# EAGLE board zulu_a7 (EAGLE 9.7.0), part 1 of 2
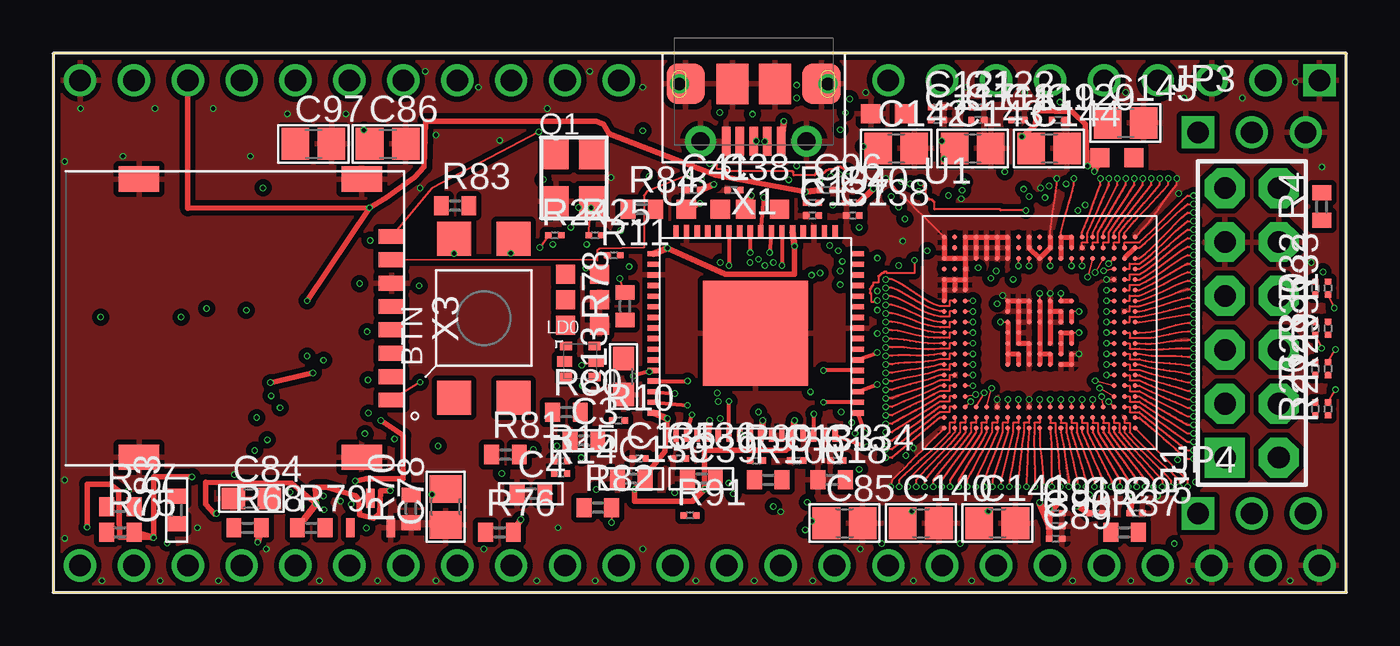
[diagram p7: board, top side]
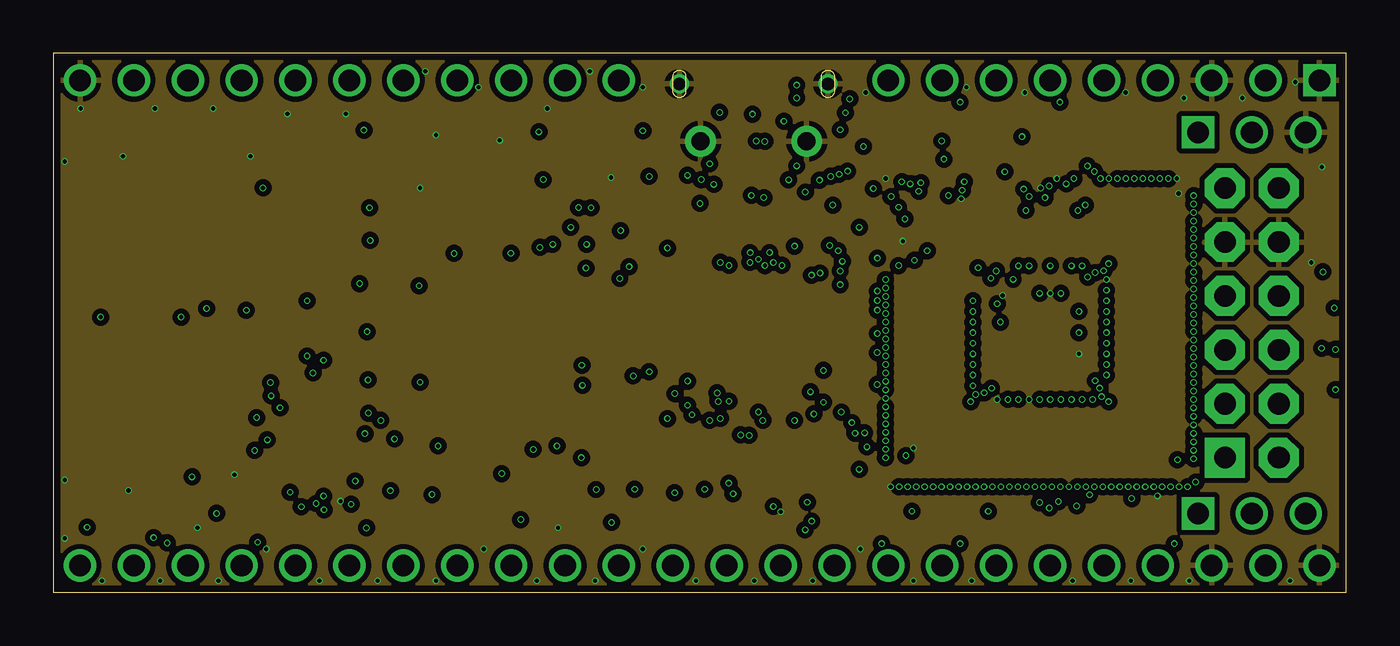
[diagram p8: board, inner layer Route2]
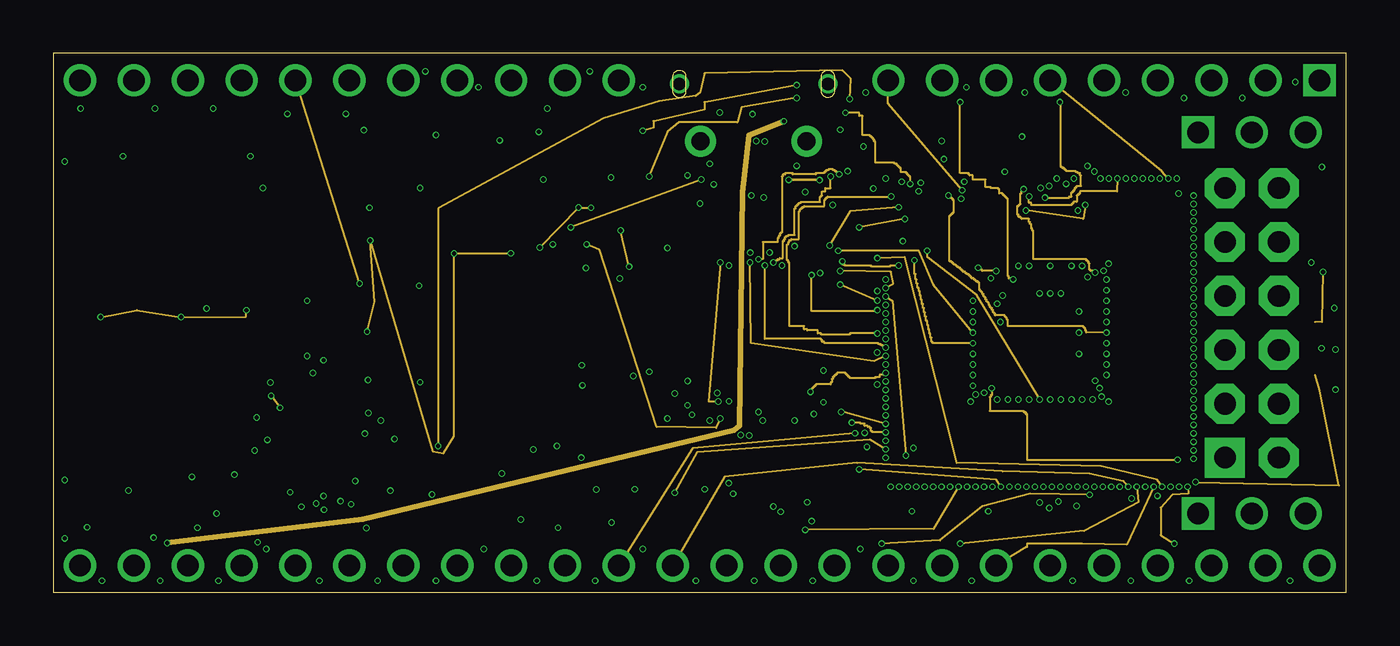
[diagram p9: board, inner layer Route3]
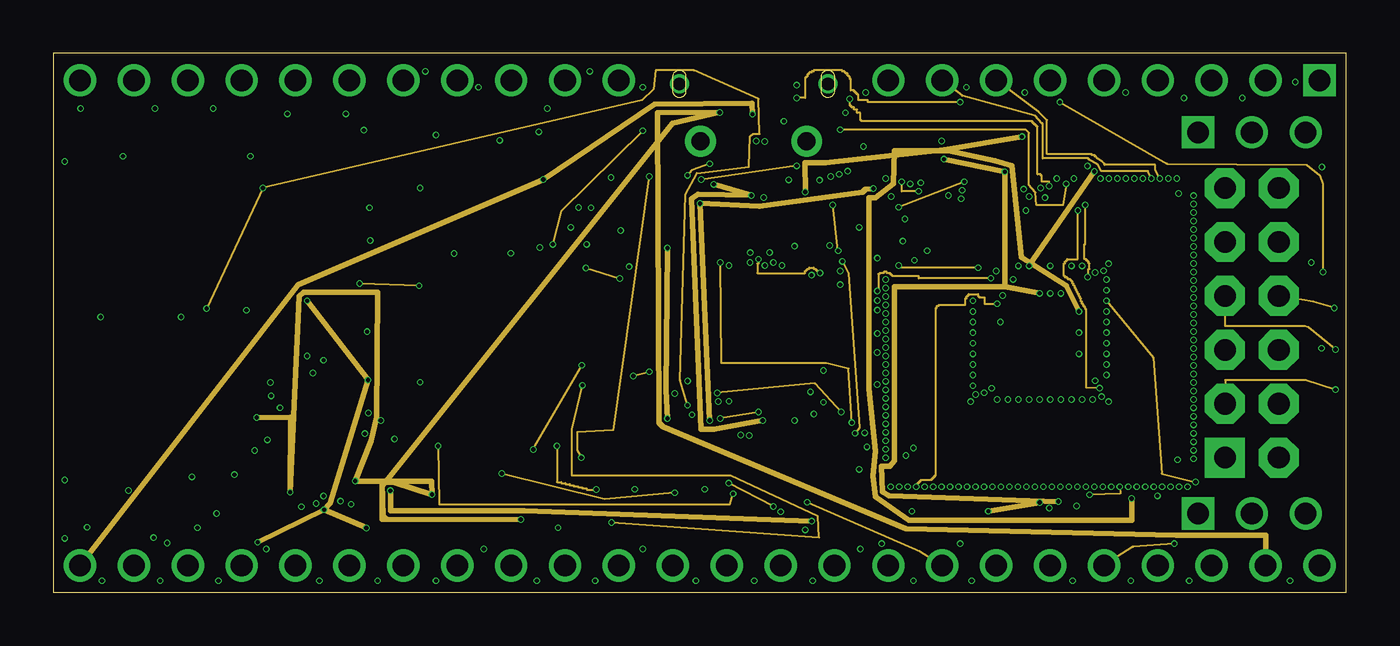
[diagram p10: board, inner layer Route4]
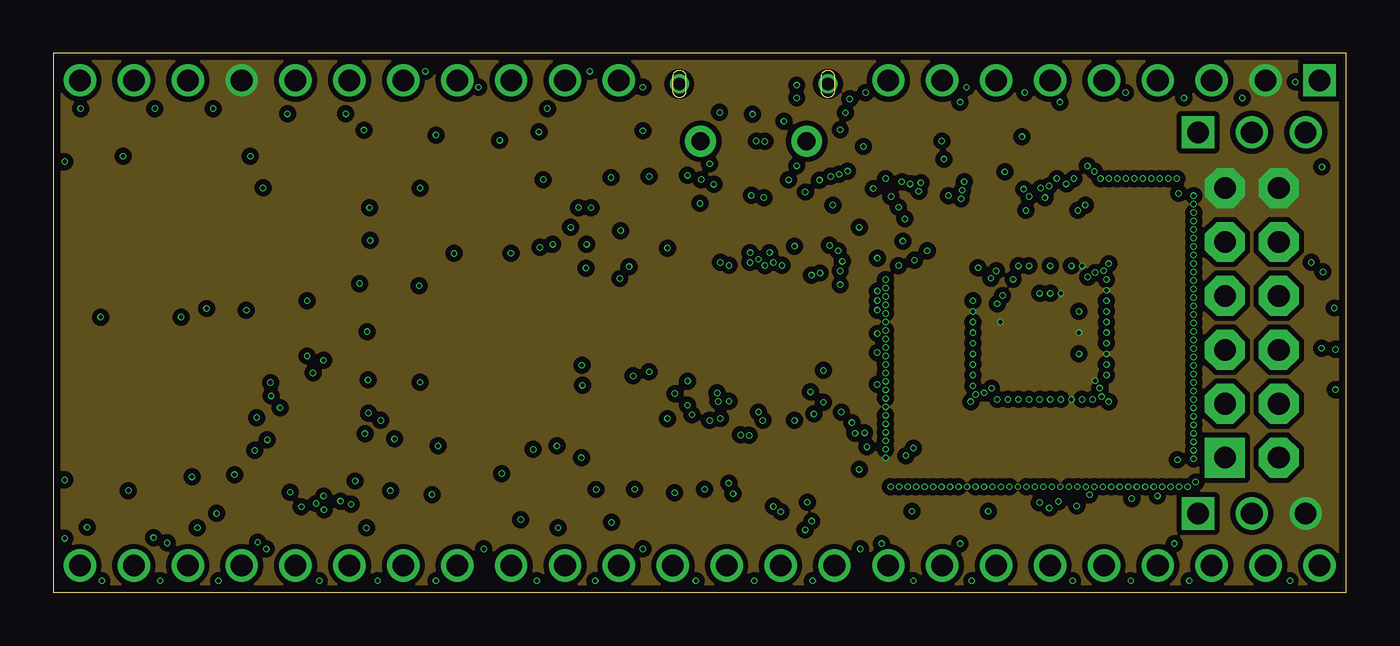
[diagram p11: board, inner layer Route5]
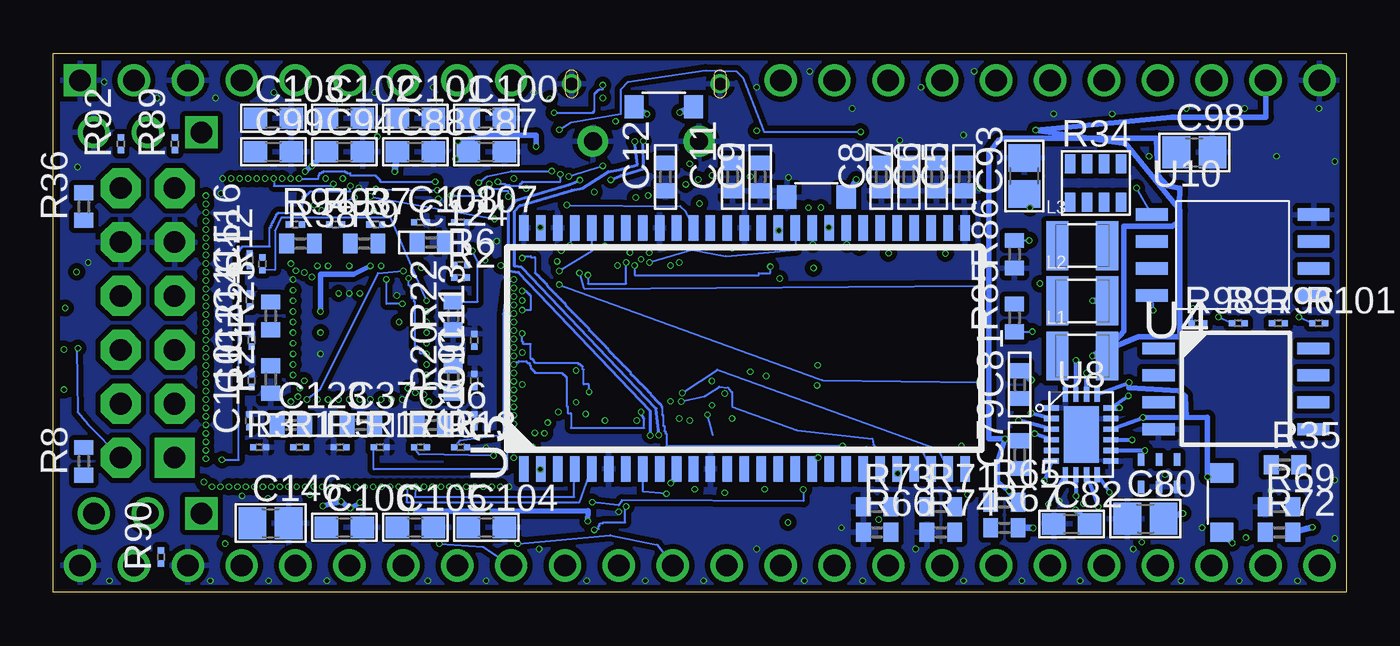
[diagram p12: board, bottom side, seen from below]

Size 60.96 x 25.4 mm. Coordinates in mm from the lower left corner, seen from the top.
Outline: 0,0 60.96,0 60.96,25.4 0,25.4 0,0
Copper layers (1*2*3*4*5*16): Top 0.035mm / dielectric 0.0994mm / Route2 0.0152mm / dielectric 0.55mm / Route3 0.0152mm / dielectric 0.1164mm / Route4 0.0152mm / dielectric 0.55mm / Route5 0.0152mm / dielectric 0.0994mm / Bottom
Design rules "Zulu A7 6 layer JLCPCB": minimum track width 0.0762mm, minimum drill 0.2mm, track to track 0.09mm, track to pad 0.09mm, pad to pad 0.09mm, via to via 0.09mm, smd to smd 0.09mm, copper to edge 0.3mm, drill to drill 0.2mm, minimum pad ring 0.1mm, minimum via ring 0.05mm, stop-mask expansion 0.05mm, vias tented up to drill 0mm, thermal gap 0.25mm
Net classes: 1 power: clearance 0.254 mm; 2 usb-diff: width 0.15 mm, clearance 0.125 mm

## Footprints (pad centres in the part's own frame; a part is rotated, then mirrored left to right if it is on the bottom)
PTA-142 = smd 1.6 x 1.6: 1 -3.75,1.4; 2 -3.75,-1.4; 3 3.75,-1.4; 4 3.75,1.4
C0402 = smd 0.7 x 0.9: 1 -0.65,0; 2 0.65,0
C0603 = smd 1.1 x 1: 1 -0.85,0; 2 0.85,0
C0201 = smd 0.3 x 0.3: 1 -0.3,0; 2 0.3,0
C0805 = smd 1.3 x 1.5: 1 -0.85,0; 2 0.85,0
SOD123 = smd 0.9 x 1.1: A -1.4,0; K 1.4,0
2X06 = drill 1.016 pad 1.88 square: 1 -6.35,1.27 | drill 1.016 pad 1.88 octagon: 2 -3.81,1.27; 3 -1.27,1.27; 4 1.27,1.27; 5 3.81,1.27; 6 6.35,1.27; 7 -6.35,-1.27; 8 -3.81,-1.27; 9 -1.27,-1.27; 10 1.27,-1.27; 11 3.81,-1.27; 12 6.35,-1.27
1X03-NOSILK = drill 1.016 square: 1 -2.54,0 | drill 1.016: 2 0,0; 3 2.54,0
IND2520 = smd 1.05 x 2.3: 1 -1.175,0; 2 1.175,0
IND0603 = smd 0.9 x 0.9: 1 -0.8,0; 2 0.8,0
VS-NRD8 = smd 0.55 x 0.4: 1 -0.675,0.725; 3 -0.675,-0.725; 4 0.675,0.725; 6 0.675,-0.725 | smd 0.7 x 0.5: 2 -0.75,0; 5 0.75,0
LED0603 = smd 0.9 x 0.9: A -0.8,0; K 0.8,0
32X25 = smd 1.2 x 1.4: 1 0,0; 2 0,-2.2; 3 1.7,-2.2; 4 1.7,0
SOT23-3 = smd 0.4 x 0.9: D 0,0.7; G -0.95,-0.7; S 0.95,-0.7
SOT363 = smd 0.3 x 0.6: 1 -0.85,-0.65; 2 0,-0.65; 3 0.85,-0.65; 4 0.85,0.65; 5 0,0.65; 6 -0.85,0.65
R0201 = smd 0.3 x 0.3: 1 -0.3,0; 2 0.3,0
R0402 = smd 0.7 x 0.9: 1 -0.65,0; 2 0.65,0
742C083 = smd 0.5 x 0.9: 1 -0.4,-0.9; 2 0.4,-0.9; 3 1.2,-0.9; 4 2,-0.9; 5 2,0.9; 6 1.2,0.9; 7 0.4,0.9; 8 -0.4,0.9
XC7A35T-CPG236 = smd 0.225 x 0.225: A1 0,0; A2 0.5,0; A3 1,0; A4 1.5,0; A5 2,0; A6 2.5,0; A7 3,0; A8 3.5,0; A9 4,0; A10 4.5,0; A11 5,0; A12 5.5,0; A13 6,0; A14 6.5,0; A15 7,0; A16 7.5,0; A17 8,0; A18 8.5,0; A19 9,0; B1 0,-0.5; B2 0.5,-0.5; B3 1,-0.5; B4 1.5,-0.5; B5 2,-0.5; B6 2.5,-0.5; B7 3,-0.5; B8 3.5,-0.5; B9 4,-0.5; B10 4.5,-0.5; B11 5,-0.5; B12 5.5,-0.5; B13 6,-0.5; B14 6.5,-0.5; B15 7,-0.5; B16 7.5,-0.5; B17 8,-0.5; B18 8.5,-0.5; B19 9,-0.5; C1 0,-1; C2 0.5,-1; C3 1,-1; C4 1.5,-1; C5 2,-1; C6 2.5,-1; C7 3,-1; C8 3.5,-1; C9 4,-1; C10 4.5,-1; C11 5,-1; C12 5.5,-1; C13 6,-1; C14 6.5,-1; C15 7,-1; C16 7.5,-1; C17 8,-1; C18 8.5,-1; C19 9,-1; D1 0,-1.5; D2 0.5,-1.5; D3 1,-1.5; D17 8,-1.5; D18 8.5,-1.5; D19 9,-1.5; E1 0,-2; E2 0.5,-2; E3 1,-2; E17 8,-2; E18 8.5,-2; E19 9,-2; F1 0,-2.5; F2 0.5,-2.5; F3 1,-2.5; F17 8,-2.5; F18 8.5,-2.5; F19 9,-2.5; G1 0,-3; G2 0.5,-3; G3 1,-3; G7 3,-3; G8 3.5,-3; G9 4,-3; G10 4.5,-3; G11 5,-3; G12 5.5,-3; G13 6,-3; G17 8,-3; G18 8.5,-3; G19 9,-3; H1 0,-3.5; H2 0.5,-3.5; H3 1,-3.5; H7 3,-3.5; H8 3.5,-3.5; H9 4,-3.5; H10 4.5,-3.5; H11 5,-3.5; H12 5.5,-3.5; H13 6,-3.5; H17 8,-3.5; H18 8.5,-3.5; H19 9,-3.5; J1 0,-4; J2 0.5,-4; J3 1,-4; J7 3,-4; J8 3.5,-4; J9 4,-4; J10 4.5,-4; J11 5,-4; J12 5.5,-4; J13 6,-4; J17 8,-4; J18 8.5,-4; J19 9,-4; K1 0,-4.5; K2 0.5,-4.5; K3 1,-4.5; K7 3,-4.5; K8 3.5,-4.5; K12 5.5,-4.5; K13 6,-4.5; K17 8,-4.5; K18 8.5,-4.5; K19 9,-4.5; L1 0,-5; L2 0.5,-5; L3 1,-5; L7 3,-5; L8 3.5,-5; L9 4,-5; L10 4.5,-5; L11 5,-5; L12 5.5,-5; L13 6,-5; L17 8,-5; L18 8.5,-5; L19 9,-5; M1 0,-5.5; M2 0.5,-5.5; M3 1,-5.5; M7 3,-5.5; M8 3.5,-5.5; M9 4,-5.5; M10 4.5,-5.5; M11 5,-5.5; M12 5.5,-5.5; M13 6,-5.5; M17 8,-5.5; M18 8.5,-5.5; M19 9,-5.5; N1 0,-6; N2 0.5,-6; N3 1,-6; N7 3,-6; N8 3.5,-6; N9 4,-6; N10 4.5,-6; N11 5,-6; N12 5.5,-6; N13 6,-6; N17 8,-6; N18 8.5,-6; N19 9,-6; P1 0,-6.5; P2 0.5,-6.5; P3 1,-6.5; P17 8,-6.5; P18 8.5,-6.5; P19 9,-6.5; R1 0,-7; R2 0.5,-7; R3 1,-7; R17 8,-7; R18 8.5,-7; R19 9,-7; T1 0,-7.5; T2 0.5,-7.5; T3 1,-7.5; T17 8,-7.5; T18 8.5,-7.5; T19 9,-7.5; U1 0,-8; U2 0.5,-8; U3 1,-8; U4 1.5,-8; U5 2,-8; U6 2.5,-8; U7 3,-8; U8 3.5,-8; U9 4,-8; U10 4.5,-8; U11 5,-8; U12 5.5,-8; U13 6,-8; U14 6.5,-8; U15 7,-8; U16 7.5,-8; U17 8,-8; U18 8.5,-8; U19 9,-8; V1 0,-8.5; V2 0.5,-8.5; V3 1,-8.5; V4 1.5,-8.5; V5 2,-8.5; V6 2.5,-8.5; V7 3,-8.5; V8 3.5,-8.5; V9 4,-8.5; V10 4.5,-8.5; V11 5,-8.5; V12 5.5,-8.5; V13 6,-8.5; V14 6.5,-8.5; V15 7,-8.5; V16 7.5,-8.5; V17 8,-8.5; V18 8.5,-8.5; V19 9,-8.5; W1 0,-9; W2 0.5,-9; W3 1,-9; W4 1.5,-9; W5 2,-9; W6 2.5,-9; W7 3,-9; W8 3.5,-9; W9 4,-9; W10 4.5,-9; W11 5,-9; W12 5.5,-9; W13 6,-9; W14 6.5,-9; W15 7,-9; W16 7.5,-9; W17 8,-9; W18 8.5,-9; W19 9,-9
FT2232HQ-QFN64 = smd 0.25 x 0.6: 1 -3.75,-4.8; 2 -3.25,-4.8; 3 -2.75,-4.8; 4 -2.25,-4.8; 5 -1.75,-4.8; 6 -1.25,-4.8; 7 -0.75,-4.8; 8 -0.25,-4.8; 9 0.25,-4.8; 10 0.75,-4.8; 11 1.25,-4.8; 12 1.75,-4.8; 13 2.25,-4.8; 14 2.75,-4.8; 15 3.25,-4.8; 16 3.75,-4.8; 33 3.75,4.8; 34 3.25,4.8; 35 2.75,4.8; 36 2.25,4.8; 37 1.75,4.8; 38 1.25,4.8; 39 0.75,4.8; 40 0.25,4.8; 41 -0.25,4.8; 42 -0.75,4.8; 43 -1.25,4.8; 44 -1.75,4.8; 45 -2.25,4.8; 46 -2.75,4.8; 47 -3.25,4.8; 48 -3.75,4.8 | smd 0.6 x 0.25: 17 4.8,-3.75; 18 4.8,-3.25; 19 4.8,-2.75; 20 4.8,-2.25; 21 4.8,-1.75; 22 4.8,-1.25; 23 4.8,-0.75; 24 4.8,-0.25; 25 4.8,0.25; 26 4.8,0.75; 27 4.8,1.25; 28 4.8,1.75; 29 4.8,2.25; 30 4.8,2.75; 31 4.8,3.25; 32 4.8,3.75; 49 -4.8,3.75; 50 -4.8,3.25; 51 -4.8,2.75; 52 -4.8,2.25; 53 -4.8,1.75; 54 -4.8,1.25; 55 -4.8,0.75; 56 -4.8,0.25; 57 -4.8,-0.25; 58 -4.8,-0.75; 59 -4.8,-1.25; 60 -4.8,-1.75; 61 -4.8,-2.25; 62 -4.8,-2.75; 63 -4.8,-3.25; 64 -4.8,-3.75 | smd 4.95 x 4.95: EP 0,0
TSOPII-54 = smd 1.2 x 0.45: 1 0,0; 2 0,-0.8; 3 0,-1.6; 4 0,-2.4; 5 0,-3.2; 6 0,-4; 7 0,-4.8; 8 0,-5.6; 9 0,-6.4; 10 0,-7.2; 11 0,-8; 12 0,-8.8; 13 0,-9.6; 14 0,-10.4; 15 0,-11.2; 16 0,-12; 17 0,-12.8; 18 0,-13.6; 19 0,-14.4; 20 0,-15.2; 21 0,-16; 22 0,-16.8; 23 0,-17.6; 24 0,-18.4; 25 0,-19.2; 26 0,-20; 27 0,-20.8; 28 11.36,-20.8; 29 11.36,-20; 30 11.36,-19.2; 31 11.36,-18.4; 32 11.36,-17.6; 33 11.36,-16.8; 34 11.36,-16; 35 11.36,-15.2; 36 11.36,-14.4; 37 11.36,-13.6; 38 11.36,-12.8; 39 11.36,-12; 40 11.36,-11.2; 41 11.36,-10.4; 42 11.36,-9.6; 43 11.36,-8.8; 44 11.36,-8; 45 11.36,-7.2; 46 11.36,-6.4; 47 11.36,-5.6; 48 11.36,-4.8; 49 11.36,-4; 50 11.36,-3.2; 51 11.36,-2.4; 52 11.36,-1.6; 53 11.36,-0.8; 54 11.36,0
SOIC-8_208MIL = smd 1.51 x 0.56: 1 0.299,0; 2 0.299,-1.27; 3 0.299,-2.54; 4 0.299,-3.81; 5 7.599,-3.81; 6 7.599,-2.54; 7 7.599,-1.27; 8 7.599,0
LTC3569-QFN20 = smd 0.7 x 0.25: 1 -1.4,1.25; 2 -1.4,0.75; 3 -1.4,0.25; 4 -1.4,-0.25; 5 -1.4,-0.75; 6 -1.4,-1.25; 11 1.4,-1.25; 12 1.4,-0.75; 13 1.4,-0.25; 14 1.4,0.25; 15 1.4,0.75; 16 1.4,1.25 | smd 0.25 x 0.7: 7 -0.75,-1.9; 8 -0.25,-1.9; 9 0.25,-1.9; 10 0.75,-1.9; 17 0.75,1.9; 18 0.25,1.9; 19 -0.25,1.9; 20 -0.75,1.9 | smd 1.65 x 2.65: 21 0,0
SOIC8 = smd 1.5 x 0.6: 1 -3.81,1.905; 2 -3.81,0.635; 3 -3.81,-0.635; 4 -3.81,-1.905; 5 3.81,1.905; 6 3.81,0.635; 7 3.81,-0.635; 8 3.81,-1.905
MOLEX-105017-0001 = smd 0.4 x 1.35: 1 1.3,0; 2 0.65,0; 3 0,0; 4 -0.65,0; 5 -1.3,0 | drill 0.85 pad 1.45: MH1 -2.5,0; MH2 2.5,0 | smd 1.8 x 1.9: MP1 -3.2,2.7; MP4 3.2,2.7 | smd 1.5 x 1.9: MP2 -1,2.7; MP3 1,2.7 | drill 0.6 pad 0.9: MS1 -3.5,2.7; MS2 3.5,2.7
ZULU-DIP37 = drill 1.016 square: 1 59.69,24.13 | drill 1.016: 2 57.15,24.13; 3 54.61,24.13; 4 52.07,24.13; 5 49.53,24.13; 6 46.99,24.13; 7 44.45,24.13; 8 41.91,24.13; 9 39.37,24.13; 10 26.67,24.13; 11 24.13,24.13; 12 21.59,24.13; 13 19.05,24.13; 14 16.51,24.13; 15 13.97,24.13; 16 11.43,24.13; 17 8.89,24.13; 18 6.35,24.13; 19 3.81,24.13; 20 1.27,24.13; 21 59.69,1.27; 22 57.15,1.27; 23 54.61,1.27; 24 52.07,1.27; 25 49.53,1.27; 26 46.99,1.27; 27 44.45,1.27; 28 41.91,1.27; 29 39.37,1.27; 30 36.83,1.27; 31 34.29,1.27; 32 31.75,1.27; 33 29.21,1.27; 34 26.67,1.27; 35 24.13,1.27; 36 21.59,1.27; 37 19.05,1.27; 38 16.51,1.27; 39 13.97,1.27; 40 11.43,1.27; 41 8.89,1.27; 42 6.35,1.27; 43 3.81,1.27; 44 1.27,1.27
DM3AT-SF-PEJM5 = smd 0.7 x 1.2: 1 3.85,0; 2 2.75,0; 3 1.65,0; 4 0.55,0; 5 -0.55,0; 6 -1.65,0; 7 -2.75,0; 8 -3.85,0 | smd 1.2 x 1.9: G1 -6.55,-1.4; G2 6.55,-1.4; G3 -6.55,-11.9; G4 6.55,-11.9

## Placement (x,y rotation side)
BTN  PTA-142  [PTA-142]  20.3,12.92 90 top
C3  0.1uF  [C0402]  25.02,7.15 0 top
C4  0.1uF  [C0402]  22.52,4.65 0 top
C5  0.1uF  [C0402]  18.02,19.58 90 bottom
C6  0.1uF  [C0402]  19.32,19.58 90 bottom
C7  0.1uF  [C0402]  20.62,19.58 90 bottom
C8  0.1uF  [C0402]  21.93,19.58 90 bottom
C9  0.1uF  [C0402]  27.63,19.58 90 bottom
C11  0.1uF  [C0402]  28.93,19.58 90 bottom
C12  0.1uF  [C0402]  32.09,19.58 90 bottom
C13  10uF  [C0603]  26.89,10.17 90 top
C36  1nF  [C0402]  43.15,7.89 0 bottom
C37  1nF  [C0402]  46.45,7.89 0 bottom
C38  0.01uF  [C0201]  32.09,18.96 0 top
C39  3.3uF  [C0402]  30.56,5.36 0 top
C40  100nF  [C0201]  37.69,18.36 0 top
C41  100nF  [C0201]  30.19,18.96 0 top
C78  22uF 10V  [C0805]  18.51,4.03 90 top
C79  20pF  [C0402]  15.4,6.49 90 bottom
C80  22uF  [C0805]  9.48,3.48 0 bottom
C81  20pF  [C0402]  15.4,9.79 90 bottom
C82  10uF  [C0603]  12.95,3.23 0 bottom
C83  20pF  [C0402]  5.83,3.88 90 top
C84  10uF  [C0603]  9.35,4.42 0 top
C85  22uF  [C0805]  37.3,3.27 0 top
C86  22uF  [C0805]  15.77,21.13 0 top
C87  4.7uF  [C0603]  40.53,20.77 0 bottom
C88  4.7uF  [C0603]  43.88,20.77 0 bottom
C89  0.47uF  [C0201]  47.25,2.53 0 top
C90  0.47uF  [C0201]  47.25,3.13 0 top
C91  0.47uF  [C0201]  47.25,3.73 0 top
C92  0.47uF  [C0201]  49.15,3.73 0 top
C93  22uF  [C0805]  15.18,19.62 90 bottom
C94  4.7uF  [C0603]  47.23,20.77 0 bottom
C95  0.47uF  [C0201]  51.05,3.73 0 top
C96  0.47uF  [C0201]  36.45,18.96 0 top
C97  22uF  [C0805]  12.27,21.13 0 top
C98  22uF  [C0805]  7.17,20.73 0 bottom
C99  4.7uF  [C0603]  50.58,20.77 0 bottom
C100  4.7uF  [C0603]  40.53,22.34 0 bottom
C101  4.7uF  [C0603]  43.88,22.34 0 bottom
C102  4.7uF  [C0603]  47.23,22.34 0 bottom
C103  4.7uF  [C0603]  50.58,22.34 0 bottom
C104  4.7uF  [C0603]  40.53,3.06 0 bottom
C105  4.7uF  [C0603]  43.88,3.06 0 bottom
C106  4.7uF  [C0603]  47.23,3.06 0 bottom
C107  0.47uF  [C0201]  41.75,17.44 0 bottom
C108  0.47uF  [C0201]  43.64,17.44 0 bottom
C109  0.47uF  [C0201]  41.1,8.09 90 bottom
C110  0.47uF  [C0201]  51.7,8.09 90 bottom
C111  0.47uF  [C0201]  41.1,9.98 90 bottom
C112  0.47uF  [C0201]  51.6,9.98 90 bottom
C113  0.47uF  [C0201]  41.1,11.88 90 bottom
C114  0.47uF  [C0201]  51.6,11.88 90 bottom
C115  0.47uF  [C0201]  51.69,13.78 90 bottom
C116  0.47uF  [C0201]  51.69,15.67 90 bottom
C117  0.47uF  [C0201]  41.69,22.26 0 top
C118  0.47uF  [C0201]  43.58,22.26 0 top
C119  0.47uF  [C0201]  45.48,22.26 0 top
C120  0.47uF  [C0201]  47.37,22.26 0 top
C121  0.47uF  [C0201]  41.69,22.86 0 top
C122  0.47uF  [C0201]  43.58,22.86 0 top
C123  100nF  [C0402]  49.75,7.89 0 bottom
C124  470nF  [C0402]  43.15,16.49 0 bottom
C133  0.1uF  [C0201]  35.05,6.21 0 top
C134  0.1uF  [C0201]  36.95,6.21 0 top
C135  0.1uF  [C0201]  27.62,6.31 0 top
C136  0.1uF  [C0201]  29.52,6.31 0 top
C137  0.1uF  [C0201]  35.79,17.76 0 top
C138  0.1uF  [C0201]  37.69,17.76 0 top
C139  3.3uF  [C0402]  27.26,5.36 0 top
C140  22uF  [C0805]  40.9,3.27 0 top
C141  22uF  [C0805]  44.51,3.27 0 top
C142  22uF  [C0805]  39.74,20.92 0 top
C143  22uF  [C0805]  43.34,20.92 0 top
C144  22uF  [C0805]  46.94,20.92 0 top
C145  22uF  [C0805]  50.55,22.12 0 top
C146  22uF  [C0805]  50.7,3.27 0 bottom
D1  PMEG2020EJ,115  [SOD123]  5.88,4.23 90 bottom
D2  PMEG2020EJ,115  [SOD123]  32.17,22.88 0 bottom
D3  SMF5.0A  [SOD123]  24.98,18.63 0 bottom
J1  Pmod 2x6  [2X06]  56.5,12.7 90 top
JP3  JTAG TCK/TMS/GND  [1X03-NOSILK]  56.5,21.68 0 top
JP4  JTAG TDI/TDO/3V3  [1X03-NOSILK]  56.5,3.72 0 top
L1  1.5uH  [IND2520]  12.45,11.14 0 bottom
L2  3.3uH  [IND2520]  12.45,13.74 0 bottom
L3  2.2uH  [IND2520]  12.45,16.34 0 bottom
L4  FB 600R@100MHz  [IND0603]  30.65,18.06 0 top
L5  FB 600R@100MHz  [IND0603]  33.45,18.06 0 top
L6  FB 600R@100MHz  [IND0603]  39.34,22.56 0 top
L7  FB 600R@100MHz  [IND0603]  50.14,20.48 0 top
LD0  VS NRD8  [VS-NRD8]  24.85,10.88 0 top
LD1  red  [LED0603]  24.95,12.59 0 top
LD2  red  [LED0603]  24.95,13.79 0 top
LD5  green  [LED0603]  24.95,14.98 0 top
Q1  12MHz 25ppm (FPGA + FT2232HQ)  [32X25]  23.7,20.63 0 top
Q2  2N7002  [SOT23-3]  14.97,3.74 0 top
Q3  MBT3904DW1T1  [SOT363]  8.82,5.62 0 bottom
R1  4.7K  [R0201]  49.33,6.84 0 bottom
R2  4.7K  [R0201]  41.75,14.83 0 bottom
R3  4.7K  [R0201]  51.23,6.84 0 bottom
R4  100  [R0402]  59.79,18.18 90 top
R5  5.1K  [R0201]  47.44,6.84 0 bottom
R6  4.7K  [R0201]  41.75,15.43 0 bottom
R7  4.7K  [R0201]  45.75,17.34 0 bottom
R8  100  [R0402]  59.51,6.18 90 bottom
R9  100  [R0402]  46.3,16.44 0 bottom
R10  2.32K  [R0201]  26.64,8.1 0 top
R11  1K  [R0201]  26.43,15.88 0 top
R12  140  [R0201]  51.09,15.48 90 bottom
R13  845  [R0201]  41.75,6.84 0 bottom
R14  2.32K  [R0201]  23.93,5.6 0 top
R15  1K  [R0201]  23.93,6.2 0 top
R16  140  [R0201]  43.64,6.84 0 bottom
R17  845  [R0201]  45.54,6.84 0 bottom
R18  12K 1%  [R0402]  36.7,5.31 0 top
R19  10K  [R0201]  35.79,18.36 0 top
R20  1K  [R0402]  42.1,10.04 90 bottom
R21  1K  [R0402]  50.7,10.04 90 bottom
R22  1K  [R0402]  42.1,13.03 90 bottom
R23  1K  [R0402]  50.7,13.03 90 bottom
R24  33  [R0201]  23.65,16.83 0 top
R25  33  [R0201]  25.54,16.83 0 top
R26  200  [R0201]  59.49,8.65 90 top
R27  200  [R0201]  60.09,8.65 90 top
R28  200  [R0201]  59.49,10.54 90 top
R29  200  [R0201]  60.09,10.54 90 top
R30  200  [R0201]  59.49,12.44 90 top
R31  200  [R0201]  60.09,12.44 90 top
R32  200  [R0201]  59.49,14.34 90 top
R33  200  [R0201]  60.09,14.34 90 top
R34  4.7K  [742C083]  12.62,19.29 0 bottom
R35  4.7K  [R0402]  2.9,6.02 0 bottom
R36  100  [R0402]  59.51,18.18 90 bottom
R37  100  [R0402]  50.5,2.83 0 top
R38  100  [R0402]  49.29,16.44 0 bottom
R65  30K 1%  [R0402]  16.12,4.24 0 bottom
R66  120K 1%  [R0402]  22.11,2.83 0 bottom
R67  3.48K 1%  [R0402]  16.12,3.04 0 bottom
R68  150K 1%  [R0402]  9.17,3.04 0 top
R69  120K 1%  [R0402]  3.17,4.03 0 bottom
R70  10K 1%  [R0402]  16.87,3.94 90 top
R71  180K 1%  [R0402]  19.12,4.03 0 bottom
R72  0 (No Load, DNP)  [R0402]  3.17,2.83 0 bottom
R73  57.6K 1%  [R0402]  22.11,4.03 0 bottom
R74  100K  [R0402]  19.12,2.83 0 bottom
R75  100K  [R0402]  3.17,2.83 0 top
R76  100K  [R0402]  21.04,2.83 0 top
R77  100K  [R0402]  3.17,4.03 0 top
R78  680  [R0402]  26.95,13.48 90 top
R79  1K  [R0402]  12.17,3.04 0 top
R80  33  [R0402]  24.2,8.5 0 top
R81  330  [R0402]  21.32,6.5 0 top
R82  33  [R0402]  25.67,4 0 top
R83  330  [R0402]  18.95,18.22 0 top
R84  330  [R0402]  27.75,18.06 0 top
R85  10K  [R0402]  15.65,12.94 90 bottom
R86  10K  [R0402]  15.65,15.93 90 bottom
R89  10K  [R0201]  55.22,21.14 90 bottom
R90  10K  [R0201]  55.87,1.67 90 bottom
R91  10K  [R0201]  30.02,3.63 0 top
R92  10K  [R0201]  57.76,21.14 90 bottom
R93  10K  [R0201]  47.64,17.34 0 bottom
R94  10K  [R0201]  49.54,17.34 0 bottom
R96  10k  [R0201]  3.2,12.68 0 bottom
R97  10k  [R0201]  5.1,12.68 0 bottom
R98  10k  [R0201]  7,12.68 0 bottom
R99  4.7k  [R0201]  33.16,6.21 0 top
R100  330  [R0402]  33.71,5.31 0 top
R101  2.21k  [R0201]  1.31,12.68 0 bottom
U1  XC7A35T-1CPG236C  [XC7A35T-CPG236]  42,16.74 0 top
U2  FT2232HQ USB-UART/JTAG Bridge  [FT2232HQ-QFN64]  33.11,12.21 0 top
U3  AS4C32M16SB-6TIN  [TSOPII-54]  38.77,5.82 90 bottom
U4  W25Q128JVSIQ  [SOIC-8_208MIL]  9.15,11.49 0 bottom
U8  LTC3569EUDC#TRPBF  [LTC3569-QFN20]  12.5,7.44 0 bottom
U10  93LC46BT-I/SN  [SOIC8]  5.36,15.9 0 bottom
U$2  [CC_CC]  5.06,-6.44 0 top  (outside the outline)
U$3  [CC_BY]  10.89,-7.72 0 top  (outside the outline)
U$4  [CC_SA]  15.45,-7.72 0 top  (outside the outline)
U$5  [CC_COPYRIGHT]  21.29,-6.44 0 top  (outside the outline)
X1  Molex 105017-0001 Micro-USB-B  [MOLEX-105017-0001]  33.02,21.26 0 top
X2  [ZULU-DIP37]  0,0 0 top
X3  [DM3AT-SF-PEJM5]  15.95,12.92 270 top

## Tracks (layer width: path | path; a pad name or v marks a point on that pad's centre or on a via)
A0  (via drill 0.2 pad 0.3)
  Top 0.09: v39.24,6.74 39.54,6.74 39.82,6.96 40.1,7.18 40.39,7.4 40.67,7.61 40.95,7.83 41.23,8.05 41.52,8.27 41.8,8.49 42,8.49 42.25,8.49 42.25,8.74 U1.U2
  Route3 0.1: v39.24,6.74 38.5,7.2 30.35,6.6 v29.3,4.7
  Route4 0.1: v29.3,4.7 26,4.4 v21.15,5.6
  Bottom 0.1: v21.15,5.6 U3.23
A1  (via drill 0.2 pad 0.3)
  Top 0.076: U1.T3 v43.48,9.32
A2  (via drill 0.2 pad 0.3)
  Top 0.09: v39.24,7.54 39.54,7.54 39.82,7.73 40.1,7.91 40.39,8.08 40.67,8.26 40.95,8.43 41.23,8.61 41.52,8.8 41.8,8.99 42,8.99 42.25,8.99 42.25,9.24 U1.T2
  Route3 0.1: v39.24,7.54 38.6,7.55 38.6,7.6 38.55,7.6 38.55,7.75 38.5,7.75 38.5,7.8 38.4,7.8 38.4,7.85 38.25,7.85 38.25,7.95 38.05,7.95 38.05,8 v37.65,8 | v31.45,15.55 30.9,9 v31.35,9
  Route4 0.1: v37.65,8 37.5,10.55 36.45,10.8 31.5,10.8 v31.45,15.55
  Bottom 0.1: v31.35,9 30.25,9.25 29.55,9.7 29.15,9.65 29,9.45 28.95,9.45 28.95,8.75 25.9,7.65 22.35,7.25 22.3,6.95 22.2,6.85 20.2,6.85 20.2,6.8 19.95,6.6 U3.25
A3  (via drill 0.2 pad 0.3)
  Top 0.09: v39.24,7.94 39.54,7.94 39.82,8.11 40.1,8.27 40.39,8.43 40.67,8.58 40.95,8.74 41.23,8.9 41.52,9.06 41.8,9.24 U1.T1
  Route3 0.1: v39.24,7.94 37.3,8.5 v37.15,8.5
  Route4 0.1: v37.15,8.5 35.9,9.85 v31.3,9.4
  Bottom 0.1: v31.3,9.4 29.65,10.5 19.25,6.75 U3.26
A4  (via drill 0.2 pad 0.3)
  Top 0.076: U1.R3 v43.35,9.74
A5  (via drill 0.2 pad 0.3)
  Top 0.09: v39.24,8.34 39.54,8.34 39.82,8.49 40.1,8.63 40.39,8.77 40.67,8.9 40.95,9.04 41.23,9.18 41.52,9.33 41.8,9.49 42,9.49 42.25,9.49 42.25,9.74 U1.R2
A6  (via drill 0.2 pad 0.3)
  Top 0.076: U1.P3 v43.35,10.24
A7  (via drill 0.2 pad 0.3)
  Top 0.09: v39.24,9.54 39.54,9.54 39.82,9.64 40.1,9.72 40.39,9.8 40.67,9.87 40.95,9.95 41.23,10.03 41.52,10.13 41.8,10.24 U1.P1
A8  (via drill 0.2 pad 0.3)
  Top 0.076: U1.N3 v43.35,10.74
A9  (via drill 0.2 pad 0.3)
  Top 0.09: v39.24,9.94 39.54,9.94 39.82,10.03 40.1,10.09 40.39,10.14 40.67,10.19 40.95,10.25 41.23,10.31 41.52,10.39 41.8,10.49 42,10.49 42.25,10.49 42.25,10.74 U1.N2
A10  (via drill 0.2 pad 0.3)
  Top 0.076: U1.U3 v43.25,8.99
A11  (via drill 0.2 pad 0.3)
  Top 0.09: v39.24,10.34 39.54,10.34 39.82,10.41 40.1,10.45 40.39,10.48 40.67,10.52 40.95,10.55 41.23,10.6 41.52,10.66 41.8,10.74 U1.N1
  Route3 0.1: v39.24,10.34 39.25,10.3 39.15,10.3 39.15,10.25 38.95,10.25 38.95,10.15 38.75,10.15 38.75,10.1 37.55,10.1 37.55,10.15 37.5,10.15 37.5,10.2 37.45,10.2 37.45,10.25 37.4,10.25 37.4,10.3 37.35,10.3 37.35,10.35 36.95,10.35 36.95,10.3 36.9,10.3 36.9,10.25 36.85,10.25 36.85,10.2 36.8,10.2 36.8,10.15 36.75,10.15 36.75,10.05 36.7,10.05 36.7,9.9 36.65,9.9 36.65,9.8 35.95,9.8 35.95,9.75 35.9,9.75 35.9,9.7 35.85,9.7 35.85,9.65 35.8,9.65 35.8,9.6 35.75,9.6 35.75,9.45 v35.7,9.45 | v38.85,12.2 37.55,12.2 37.55,12.15 36.2,12.15 36.2,12.2 36.05,12.2 36.05,12.35 35.55,12.35 35.55,12.4 35.4,12.4 35.4,12.55 34.7,12.55 34.7,15.55 34.65,15.55 34.65,15.65 34.6,15.65 34.6,16.4 34.65,16.4 34.65,16.5 34.7,16.5 34.7,16.6 34.8,16.6 34.8,16.65 35.15,16.65 35.15,17.95 35.2,17.95 35.2,18.05 35.25,18.05 35.25,18.1 35.3,18.1 35.3,18.15 35.4,18.15 35.4,18.2 36.35,18.2 36.35,18.5 36.4,18.5 36.4,18.55 36.45,18.55 36.45,18.6 36.5,18.6 36.5,18.65 v39.5,18.65 | v40.4,19.25 40.4,19.6 40.35,19.6 40.35,19.65 40.3,19.65 40.3,19.7 40.25,19.7 40.25,19.75 40.2,19.75 40.2,19.8 39.95,19.8 39.95,20 39.9,20 39.9,20.05 39.85,20.05 39.85,20.1 39.8,20.1 39.8,20.15 39.75,20.15 39.75,20.2 39.65,20.2 39.65,20.25 38.75,20.25 38.75,21.25 38.7,21.25 38.7,21.35 38.65,21.35 38.65,21.4 38.6,21.4 38.6,21.45 38.55,21.45 38.55,21.5 38.5,21.5 38.5,21.55 38.15,21.55 38.15,22.45 38,22.45 38,22.6 v37.35,22.6 | v35.05,23.9 30.75,23.1 30.7,23.1 30.7,22.75 28.35,22.2 28.3,22.2 28.3,21.9 v27.8,21.75
  Route4 0.1: v27.8,21.75 23.95,17.95 v23.55,16.4
  Bottom 0.1: v35.7,9.45 35.7,9.8 35.95,9.8 35.95,10.5 36,10.5 36,10.65 36.05,10.65 36.05,10.7 36.1,10.7 36.1,10.75 36.2,10.75 36.2,10.8 38.25,10.8 38.25,10.85 38.3,10.85 38.3,10.95 38.35,10.95 38.35,11 38.45,11 38.45,11.7 38.8,11.7 38.8,11.8 38.85,11.8 v38.85,12.2 | v39.5,18.65 39.5,18.9 39.8,18.9 39.8,19 40.4,19 v40.4,19.25 | v37.35,22.6 35.5,22.6 35.5,22.65 35.45,22.65 35.45,23.5 35.4,23.5 35.4,23.55 35.35,23.55 35.35,23.6 35.3,23.6 35.3,23.65 35.25,23.65 35.25,23.7 35.05,23.7 v35.05,23.9 | v23.55,16.4 U3.35
A12  (via drill 0.2 pad 0.3)
  Top 0.076: U1.M3 v43.35,11.24
  Route3 0.1: v38.85,13.3 38.85,13.25 35.75,13.25 v35.75,14.95 | v33.95,15.55 34,15.55 34,15.65 34.15,15.65 34.15,15.7 34.25,15.7 34.25,15.75 34.4,15.75 34.4,16.55 34.45,16.55 34.45,16.65 34.5,16.65 34.5,16.75 34.55,16.75 34.55,16.8 34.65,16.8 34.65,16.85 34.95,16.85 34.95,18.1 35,18.1 35,18.2 35.05,18.2 35.05,18.25 35.1,18.25 35.1,18.3 35.15,18.3 35.15,18.35 35.25,18.35 35.25,18.4 36.15,18.4 36.15,18.65 36.2,18.65 36.2,18.7 36.25,18.7 36.25,18.9 36.4,18.9 36.4,19.05 36.65,19.05 v36.65,19.6 | v30.55,19.45 v24.4,17.2
  Route4 0.1: v44.2,14.8 40.8,14.8 40.8,14.9 39.55,14.9 39.55,14.95 39.5,14.95 39.5,15 39.45,15 39.45,15.05 39.3,15.05 39.3,15.1 39.15,15.1 39.15,15.05 38.95,15.05 38.95,15 38.9,15 38.9,14.2 v38.85,14.2 | v35.05,20.1 v30.55,19.45
  Bottom 0.1: v43.35,11.24 43.65,11.25 43.65,11.5 43.7,11.5 43.7,11.55 43.8,11.55 43.8,11.6 43.9,11.6 43.9,13.7 43.95,13.7 43.95,13.85 44.05,13.85 44.05,14.35 44.1,14.35 44.1,14.45 44.2,14.45 v44.2,14.8 | v38.85,14.2 38.65,14.2 38.65,14.15 38.6,14.15 38.6,14.1 38.55,14.1 38.55,14.05 38.5,14.05 38.5,14 38.45,14 38.45,13.3 v38.85,13.3 | v35.75,14.95 35.75,14.55 33.95,14.55 v33.95,15.55 | v36.65,19.6 v35.05,20.1
AIN15_N  (via drill 0.2 pad 0.3)
  Top 0.09: v39.24,14.74 39.54,14.74 39.82,14.62 40.1,14.45 40.39,14.26 40.67,14.06 40.95,13.88 41.23,13.72 41.52,13.59 41.8,13.49 42,13.49 42.25,13.49 42.25,13.74 U1.G2
  Bottom 0.1: v39.24,14.74 39.55,14.55 39.75,13.1 39.75,7.4 39.8,7.4 41.8,7.15 R13.1
AIN15_P  (via drill 0.2 pad 0.3)
  Top 0.076: U1.G3 v43.35,13.74
  Bottom 0.1: v43.35,13.74 45.05,17.65 50.2,17.65 50.5,17.05 50.5,15.2 R12.1
AIN16_N  (via drill 0.2 pad 0.3)
  Top 0.09: v39.24,13.14 39.54,13.14 39.82,13.09 40.1,12.99 40.39,12.89 40.67,12.77 40.95,12.67 41.23,12.58 41.52,12.52 41.8,12.49 42,12.49 42.25,12.49 42.25,12.74 U1.J2
  Bottom 0.1: v39.24,13.14 39.5,12.95 39.55,12.95 39.55,5.8 45.85,5.8 R17.1
AIN16_P  (via drill 0.2 pad 0.3)
  Top 0.09: v39.24,13.94 39.54,13.94 39.82,13.85 40.1,13.72 40.39,13.57 40.67,13.42 40.95,13.28 41.23,13.15 41.52,13.05 41.8,12.99 42,12.99 42.25,12.99 42.25,13.24 U1.H2
  Route3 0.1: v39.24,13.94 39.55,13.75 v40.2,6.45
  Bottom 0.1: v40.2,6.45 43.7,6.5 R16.1
BS0  (via drill 0.2 pad 0.3)
  Top 0.09: v39.88,4.98 39.88,5.28 40.16,5.56 40.46,5.84 40.77,6.13 41.09,6.41 41.4,6.69 41.7,6.97 41.98,7.26 42.25,7.54 42.25,7.74 42.25,7.99 42.5,7.99 U1.V2
BS1  (via drill 0.2 pad 0.3)
  Top 0.09: v39.24,7.14 39.54,7.14 39.82,7.35 40.1,7.54 40.39,7.74 40.67,7.93 40.95,8.13 41.23,8.33 41.52,8.53 41.8,8.74 U1.U1
BTN  (via drill 0.2 pad 0.3)
  Top 0.076: U1.N17 v49.65,10.74
CAS#  (via drill 0.2 pad 0.3)
  Top 0.09: v41.08,4.98 41.08,5.28 41.31,5.56 41.55,5.84 41.8,6.13 42.06,6.41 42.31,6.69 42.55,6.97 42.78,7.26 43,7.54 U1.W3
CFG-M0  (via drill 0.2 pad 0.3)
  Top 0.09: v48.28,4.98 48.28,5.28 48.21,5.56 48.14,5.84 48.08,6.13 48.02,6.41 47.96,6.69 47.89,6.97 47.82,7.26 47.75,7.54 47.75,7.74 47.75,7.99 47.5,7.99 U1.V12
CFG-M1  (via drill 0.2 pad 0.3)
  Top 0.09: v47.08,4.98 47.08,5.28 47.06,5.56 47.05,5.84 47.05,6.13 47.05,6.41 47.05,6.69 47.04,6.97 47.02,7.26 47,7.54 U1.W11
CFG-M2  (via drill 0.2 pad 0.3)
  Top 0.076: U1.U10 v46.5,9.09
  Route3 0.1: v46.5,9.09 43.55,14 41.2,15.8 v41.2,16.1
  Bottom 0.1: R22.2 40.95,13.7 40.95,15.6 v41.2,16.1
CHAN0  (via drill 0.2 pad 0.3)
  Top 0.09: v53.76,18.7 53.46,18.7 53.18,18.43 52.9,18.15 52.61,17.86 52.33,17.58 52.05,17.3 51.77,17.02 51.48,16.75 51.2,16.49 51,16.49 50.5,16.49 U1.B18
CHAN1  (via drill 0.2 pad 0.3)
  Top 0.09: v52.56,19.5 52.56,19.2 52.31,18.92 52.05,18.64 51.79,18.35 51.52,18.07 51.26,17.79 51,17.5 50.74,17.22 50.5,16.94 U1.A18
  Route3 0.1: v52.56,19.5 52.25,19.85 X2.6
CHAN2  (via drill 0.2 pad 0.3)
  Top 0.09: v52.16,19.5 52.16,19.2 51.93,18.92 51.69,18.64 51.44,18.35 51.2,18.07 50.95,17.79 50.71,17.5 50.48,17.22 50.25,16.94 50.25,16.74 50.25,16.49 50,16.49 U1.B17
  Route4 0.1: v52.16,19.5 51.95,19.9 51.95,20.15 49.55,20.15 49.55,20.2 49.45,20.3 49.2,20.45 49.15,20.55 49.1,20.55 49.1,20.6 48.95,20.6 48.95,20.65 46.85,20.65 46.85,22.25 46.45,22.65 X2.7
CHAN3  (via drill 0.2 pad 0.3)
  Top 0.09: v51.76,19.5 51.76,19.2 51.55,18.92 51.33,18.64 51.1,18.35 50.88,18.07 50.65,17.79 50.43,17.5 50.21,17.22 50,16.94 U1.A17
  Route4 0.1: v51.76,19.5 51.6,19.85 49.4,19.85 49.25,20.15 48.8,20.4 48.8,20.45 46.65,20.45 46.65,22.1 46.6,22.1 46.3,22.45 42.85,23.4 X2.8
CHAN4  (via drill 0.2 pad 0.3)
  Top 0.076: U1.C16 v49.11,15.07
  Route3 0.1: v49.11,15.07 49.05,15.05 49.05,15.1 49,15.1 49,15.15 48.9,15.15 48.9,15.2 48.85,15.2 48.85,15.5 48.8,15.5 48.8,15.6 48.75,15.6 48.75,15.65 48.7,15.65 48.7,15.7 46.2,15.7 46.2,17.05 46.15,17.05 46.15,17.15 46.1,17.15 46.1,17.35 46.05,17.35 46.05,17.45 46,17.45 46,17.6 45.65,17.6 45.65,17.65 45.6,17.65 45.6,17.7 45.5,17.7 45.5,17.8 45.45,17.8 45.45,18.2 45.5,18.2 45.5,18.25 45.55,18.25 45.55,18.3 45.6,18.3 45.6,18.8 45.65,18.8 45.65,18.9 45.7,18.9 45.7,18.95 45.75,18.95 v45.75,19 | v42.85,18.95 39.35,23.05 X2.9
  Bottom 0.1: v45.75,19 v42.85,18.95
CHAN5  (via drill 0.2 pad 0.3)
  Top 0.076: U1.D17 v49.52,15.15
CHAN6  (via drill 0.2 pad 0.3)
  Top 0.076: U1.H17 v49.65,13.24
CHAN7  (via drill 0.2 pad 0.3)
  Top 0.09: v53.76,13.9 53.46,13.9 53.18,13.82 52.9,13.74 52.61,13.65 52.33,13.55 52.05,13.46 51.77,13.38 51.48,13.31 51.2,13.24 U1.H19
CHAN8  (via drill 0.2 pad 0.3)
  Top 0.09: v53.76,13.5 53.46,13.5 53.18,13.44 52.9,13.37 52.61,13.3 52.33,13.23 52.05,13.16 51.77,13.1 51.48,13.04 51.2,12.99 51,12.99 50.75,12.99 50.75,12.74 U1.J18
CHAN9  (via drill 0.2 pad 0.3)
  Top 0.076: U1.J17 v49.65,12.74
CHAN10  (via drill 0.2 pad 0.3)
  Top 0.09: v53.76,13.1 53.46,13.1 53.18,13.06 52.9,13.01 52.61,12.96 52.33,12.91 52.05,12.86 51.77,12.81 51.48,12.77 51.2,12.74 U1.J19
CHAN11  (via drill 0.2 pad 0.3)
  Top 0.076: U1.K17 v49.65,12.24
  Route3 0.1: v49.65,12.24 48.7,12.25 48.7,12.35 48.65,12.35 48.65,12.45 48.6,12.45 48.6,12.5 48.55,12.5 48.55,12.55 45,12.55 45,12.85 44.95,12.85 44.95,12.95 44.9,12.95 44.9,13 44.85,13 44.85,13.05 44.4,13.05 44.4,13.15 44.35,13.15 44.35,13.2 44.3,13.2 44.3,13.3 44.25,13.3 44.25,13.4 44.2,13.4 44.2,13.45 44.15,13.45 44.15,13.55 44.1,13.55 44.1,13.65 44.05,13.65 44.05,13.7 44,13.7 44,13.8 43.95,13.8 43.95,13.9 43.9,13.9 43.9,13.95 43.85,13.95 43.85,14.05 43.8,14.05 43.8,14.15 43.75,14.15 43.75,14.2 43.7,14.2 43.7,14.25 43.65,14.25 43.65,14.6 43.6,14.6 43.6,14.65 43.5,14.65 43.5,14.7 43.45,14.7 43.45,14.75 43.4,14.75 43.4,14.8 43.3,14.8 43.3,14.85 43.25,14.85 43.25,14.9 43.2,14.9 43.2,14.95 43.15,14.95 43.15,15 43.05,15 43.05,15.05 43,15.05 43,15.1 42.9,15.1 42.9,15.15 42.85,15.15 42.85,15.2 42.8,15.2 42.8,15.25 42.75,15.25 42.75,15.3 42.65,15.3 42.65,15.35 42.6,15.35 42.6,15.4 42.55,15.4 42.55,15.45 42.45,15.45 42.45,15.5 42.4,15.5 42.4,15.55 42.35,15.55 42.35,15.6 42.25,15.6 42.25,17.75 42.3,17.75 42.3,17.8 42.35,17.8 42.35,17.85 42.4,17.85 42.4,17.9 42.45,17.9 42.45,18.5 42.4,18.5 42.4,18.55 42.35,18.55 42.35,18.6 42.3,18.6 42.3,18.65 42.25,18.65 42.25,18.7 v42.2,18.7 | v37.05,19.7 36.95,19.7 36.95,19.8 36.9,19.8 36.9,19.85 36.85,19.85 36.85,19.9 36.75,19.9 36.75,19.95 36.55,19.95 36.55,19.9 36.45,19.9 36.45,19.85 36.4,19.85 36.4,19.8 36.35,19.8 36.35,19.75 35.95,19.75 35.95,19.7 34.85,19.7 34.85,19.75 34.5,19.75 34.5,19.7 34.4,19.7 34.4,19.6 34.35,19.6 34.35,16.95 34.3,16.95 34.3,16.9 34.25,16.9 34.25,16.8 34.2,16.8 34.2,16.7 34.15,16.7 34.15,16.5 33.45,16.5 33.45,15.7 v33.25,15.7
  Route3 0.1: v14.45,14.55 X2.16
  Route4 0.1: v40.8,18.9 40,18.9 v40,19.35 | v33.25,15.7 33.25,15.5 33.2,15.5 33.2,15.05 35.45,15.05 35.45,15.15 35.5,15.15 35.5,15.2 35.55,15.2 35.55,15.25 35.65,15.25 35.65,15.3 35.85,15.3 35.85,15.25 35.95,15.25 35.95,15.2 36,15.2 36,15.15 36.05,15.15 36.05,15.05 v36.15,15.05 | v17.25,14.45 v14.45,14.55
  Bottom 0.1: v42.2,18.7 40.8,18.7 v40.8,18.9 | v40,19.35 40,19.25 39.65,19.25 39.65,19.2 39.45,19.2 39.45,19.15 38.95,19.15 38.95,19.25 38.9,19.25 38.9,19.3 38.85,19.3 38.85,19.35 37.05,19.35 v37.05,19.7 | v36.15,15.05 35.95,14.35 35.9,14.3 v17.25,14.45
CHAN12  (via drill 0.2 pad 0.3)
  Top 0.09: v53.48,4.98 53.46,5.28 53.17,5.57 52.88,5.86 52.59,6.15 52.3,6.44 52.01,6.73 51.72,7.02 51.43,7.31 51.14,7.6 U1.W19
  Route3 0.1: v53.48,4.98 53.5,4.65 52.75,4.6 52.2,4 52.2,2.7 v52.85,2.3
  Route4 0.1: v52.85,2.3 50.9,2.15 X2.25
CHAN13  (via drill 0.2 pad 0.3)
  Top 0.09: v52.68,4.98 52.68,5.28 52.41,5.56 52.14,5.84 51.85,6.13 51.57,6.41 51.28,6.69 51.01,6.97 50.75,7.26 50.5,7.54 U1.W18
CHAN14  (via drill 0.2 pad 0.3)
  Top 0.09: v51.88,4.98 51.88,5.28 51.65,5.56 51.41,5.84 51.17,6.13 50.92,6.41 50.68,6.69 50.44,6.97 50.22,7.26 50,7.54 U1.W17
  Route3 0.1: v51.88,4.98 50.6,2.25 48.5,2.3 45.9,2.3 45.9,2.15 X2.27
CHAN15  (via drill 0.2 pad 0.3)
  Top 0.09: v52.28,4.98 52.28,5.28 52.03,5.56 51.77,5.84 51.51,6.13 51.24,6.41 50.98,6.69 50.73,6.97 50.48,7.26 50.25,7.54 50.25,7.74 50.25,7.99 50,7.99 U1.V17
  Route3 0.1: v52.28,4.98 52.05,5.3 49.4,5.95 42.6,6.1 40.15,15.8 v38.85,15.75
  Route4 0.1: v23.75,6.9 23.75,5.2 23.95,5.2 23.95,5.15 24.15,5.15 24.15,5.1 24.35,5.1 24.35,5.05 24.55,5.05 24.55,5 24.75,5 24.75,4.95 24.95,4.95 24.95,4.9 25.15,4.9 25.15,4.85 v25.6,4.85 | v35.55,4.25 40.85,1.95 X2.28
  Bottom 0.1: v38.85,15.75 38.8,15.75 38.8,15.85 38.45,15.85 38.45,15.8 38.25,15.8 38.25,15.05 38.2,15.05 38.2,15 38.15,15 38.15,14.95 38.1,14.95 38.1,14.9 38.05,14.9 38.05,14.85 38,14.85 38,14.8 37.95,14.8 37.95,14.75 37.9,14.75 37.9,14.7 37.85,14.7 37.85,14.65 37.8,14.65 37.8,14.6 37.75,14.6 37.75,14.55 37.7,14.55 37.7,14.45 37.65,14.45 37.65,14.4 37.6,14.4 37.6,14.35 37.55,14.35 37.55,14.3 37.5,14.3 37.5,14.25 37.45,14.25 37.45,14.2 37.4,14.2 37.4,14.15 37.35,14.15 37.35,14.1 37.3,14.1 37.3,14.05 37.25,14.05 37.25,14 37.2,14 37.2,13.95 37.15,13.95 37.15,13.9 37.1,13.9 37.1,13.85 37.05,13.85 37.05,13.8 37,13.8 37,13.75 36.95,13.75 36.95,13.7 36.9,13.7 36.9,13.65 36.85,13.65 36.85,13.6 36.8,13.6 36.8,13.5 36.75,13.5 36.75,13.45 36.7,13.45 36.7,13.4 36.65,13.4 36.65,13.35 36.6,13.35 36.6,13.3 36.55,13.3 36.55,13.25 36.5,13.25 36.5,13.2 36.45,13.2 36.45,13.15 36.4,13.15 36.4,13.1 36.35,13.1 36.35,13.05 36.3,13.05 36.3,13 36.25,13 36.25,12.95 36.2,12.95 36.2,12.9 36.15,12.9 36.15,12.85 36.1,12.85 36.1,12.8 36.05,12.8 36.05,12.75 36,12.75 36,12.7 35.95,12.7 35.95,12.65 35.9,12.65 35.9,12.6 35.85,12.6 35.85,12.55 35.8,12.55 35.8,12.5 35.75,12.5 35.75,12.45 35.7,12.45 35.7,12.35 35.65,12.35 35.65,12.3 35.6,12.3 35.6,12.25 35.55,12.25 35.55,12.2 35.5,12.2 35.5,12.15 35.45,12.15 35.45,12.1 35.4,12.1 35.4,12.05 35.35,12.05 35.35,12 35.3,12 35.3,11.95 35.25,11.95 35.25,11.9 35.2,11.9 35.2,11.85 35.15,11.85 35.15,11.8 35.1,11.8 35.1,11.75 35.05,11.75 35.05,11.7 35,11.7 35,11.65 34.95,11.65 34.95,11.6 34.9,11.6 34.9,11.55 34.85,11.55 34.85,11.5 34.8,11.5 34.8,11.4 34.75,11.4 34.75,11.35 34.7,11.35 34.7,11.3 34.65,11.3 34.65,11.25 34.6,11.25 34.6,11.2 34.55,11.2 34.55,11.15 34.5,11.15 34.5,11.1 34.45,11.1 34.45,11.05 34.4,11.05 34.4,11 34.35,11 34.35,10.95 34.3,10.95 34.3,10.9 34.25,10.9 34.25,10.85 34.2,10.85 34.2,10.8 34.15,10.8 34.15,10.75 34.1,10.75 34.1,10.7 34.05,10.7 34.05,10.65 34,10.65 34,10.6 33.95,10.6 33.95,10.55 33.9,10.55 33.9,10.5 33.85,10.5 33.85,10.45 33.8,10.45 33.8,10.4 33.75,10.4 33.75,10.3 33.7,10.3 33.7,10.25 33.65,10.25 33.65,10.2 33.6,10.2 33.6,10.15 33.55,10.15 33.55,10.1 33.5,10.1 33.5,10.05 33.45,10.05 33.45,10 33.4,10 33.4,9.95 33.35,9.95 33.35,9.9 33.3,9.9 33.3,9.85 33.25,9.85 33.25,9.8 33.2,9.8 33.2,9.75 33.15,9.75 33.15,9.7 33.1,9.7 33.1,9.65 33.05,9.65 33.05,9.6 33,9.6 33,9.55 32.95,9.55 32.95,9.5 32.9,9.5 32.9,9.45 32.85,9.45 32.85,9.4 32.8,9.4 32.8,9.3 32.75,9.3 32.75,9.25 32.7,9.25 32.7,9.2 32.65,9.2 32.65,9.15 32.6,9.15 32.6,9.1 32.55,9.1 32.55,9.05 32.5,9.05 32.5,9 32.45,9 32.45,8.95 32.4,8.95 32.4,8.9 32.35,8.9 32.35,8.85 32.3,8.85 32.3,8.75 32.25,8.75 32.25,8.35 32.2,8.35 32.2,7.85 32.15,7.85 32.15,7.6 32.1,7.6 32.1,7.5 32.05,7.5 32.05,6.9 v23.75,6.9
  Bottom 0.1: v25.6,4.85 25.6,4.3 34.15,4.35 34.3,4.1 v35.55,4.25
CHAN16  (via drill 0.2 pad 0.3)
  Top 0.09: v51.08,4.98 51.08,5.28 50.88,5.56 50.69,5.84 50.48,6.13 50.28,6.41 50.08,6.69 49.88,6.97 49.68,7.26 49.5,7.54 U1.W16
  Route3 0.1: v51.08,4.98 51.15,4.25 48.6,2.9 v42.75,2.3
  Bottom 0.1: v42.75,2.3 40.7,2.15 X2.29
CHAN17  (via drill 0.2 pad 0.3)
  Top 0.076: U1.U16 v49.41,9.22
CHAN18  (via drill 0.2 pad 0.3)
  Top 0.09: v51.48,4.98 51.48,5.28 51.27,5.56 51.05,5.84 50.83,6.13 50.6,6.41 50.38,6.69 50.16,6.97 49.95,7.26 49.75,7.54 49.75,7.74 49.75,7.99 49.5,7.99 U1.V16
CHAN19  (via drill 0.2 pad 0.3)
  Top 0.09: v50.28,4.98 50.28,5.28 50.12,5.56 49.96,5.84 49.8,6.13 49.63,6.41 49.47,6.69 49.31,6.97 49.15,7.26 49,7.54 U1.W15
  Route3 0.1: v48.85,4.6 46.05,4.65 43.8,4.05 41.8,2.45 v39.05,2.3
  Route4 0.1: v50.28,4.98 50.3,4.65 v48.85,4.6
  Bottom 0.1: v39.05,2.3 34.7,2.7 32.5,2.25 X2.32
CHAN20  (via drill 0.2 pad 0.3)
  Top 0.09: v50.68,4.98 50.68,5.28 50.5,5.56 50.32,5.84 50.14,6.13 49.95,6.41 49.77,6.69 49.59,6.97 49.42,7.26 49.25,7.54 49.25,7.74 49.25,7.99 49,7.99 U1.V15
  Route3 0.1: v50.68,4.98 50.45,5.25 48.85,5.6 44.75,5.7 37.9,6.1 31.65,5.45 X2.33
CHAN21  (via drill 0.2 pad 0.3)
  Top 0.076: U1.U15 v49,9.09
  Route3 0.1: v44.45,15.15 43.8,15.15 43.8,15.2 43.75,15.2 43.75,15.25 43.65,15.25 43.65,15.3 v43.6,15.3 | v39.85,15.4 39.45,15.4 39.45,15.35 38.55,15.35 38.55,15.4 37.3,15.4 37.3,15.45 37.2,15.45 v37.2,15.6 | v37.8,7.5 30.15,6.8 X2.34
  Route4 0.1: v43.6,15.3 39.85,15.3 v39.85,15.4 | v37.2,15.6 37.5,15.05 38,7.75 v37.8,7.5
  Bottom 0.1: v49,9.09 48.35,9.6 45.65,15.05 v44.45,15.15
CHAN22  (via drill 0.2 pad 0.3)
  Top 0.09: v49.48,4.98 49.48,5.28 49.35,5.56 49.23,5.84 49.11,6.13 48.99,6.41 48.86,6.69 48.74,6.97 48.62,7.26 48.5,7.54 U1.W14
CHAN23  (via drill 0.2 pad 0.3)
  Top 0.09: v49.88,4.98 49.88,5.28 49.74,5.56 49.6,5.84 49.45,6.13 49.31,6.41 49.17,6.69 49.03,6.97 48.89,7.26 48.75,7.54 48.75,7.74 48.75,7.99 48.5,7.99 U1.V14
CHAN24  (via drill 0.2 pad 0.3)
  Top 0.076: U1.U14 v48.5,9.09
CHAN25  (via drill 0.2 pad 0.3)
  Top 0.09: v48.68,4.98 48.68,5.28 48.59,5.56 48.51,5.84 48.42,6.13 48.34,6.41 48.26,6.69 48.17,6.97 48.09,7.26 48,7.54 U1.W13
CHAN26  (via drill 0.2 pad 0.3)
  Top 0.09: v49.08,4.98 49.08,5.28 48.97,5.56 48.87,5.84 48.77,6.13 48.66,6.41 48.56,6.69 48.46,6.97 48.35,7.26 48.25,7.54 48.25,7.74 48.25,7.99 48,7.99 U1.V13
CHAN27  (via drill 0.2 pad 0.3)
  Top 0.09: v53.76,7.5 53.46,7.5 53.18,7.69 52.9,7.87 52.61,8.05 52.33,8.24 52.05,8.42 51.77,8.61 51.48,8.8 51.2,8.99 51,8.99 50.75,8.99 50.75,9.24 U1.T18
CHAN28  (via drill 0.2 pad 0.3)
  Top 0.09: v53.76,8.7 53.46,8.7 53.18,8.83 52.9,8.96 52.61,9.08 52.33,9.21 52.05,9.33 51.77,9.46 51.48,9.6 51.2,9.74 U1.R19
CHAN-CLK  (via drill 0.2 pad 0.3)
  Top 0.09: v53.76,9.1 53.46,9.1 53.18,9.22 52.9,9.32 52.61,9.43 52.33,9.53 52.05,9.63 51.77,9.74 51.48,9.86 51.2,9.99 51,9.99 50.75,9.99 50.75,10.24 U1.P18
CKE  (via drill 0.2 pad 0.3)
  Top 0.09: v39.24,10.74 39.54,10.74 39.82,10.79 40.1,10.81 40.39,10.83 40.67,10.84 40.95,10.85 41.23,10.88 41.52,10.93 41.8,10.99 42,10.99 42.25,10.99 42.25,11.24 U1.M2
  Route3 0.1: v31.45,8.2 31.25,7.75 28.45,7.8 25.75,16.15 v25.15,16.4
  Route4 0.1: v33.25,8.5 v31.45,8.2
  Bottom 0.1: v39.24,10.74 39.2,10.75 39.2,10.8 39.1,10.8 39.1,10.85 39,10.85 39,10.9 38.65,10.9 38.65,10.85 38.6,10.85 38.6,10.8 38.5,10.8 38.5,10.7 38.45,10.7 38.45,10.55 38.4,10.55 38.4,10.5 38.35,10.5 38.35,10.45 38.3,10.45 38.3,10.4 38.25,10.4 38.25,10.35 36.95,10.35 36.95,10.3 36.9,10.3 36.9,10.25 36.85,10.25 36.85,10.2 36.8,10.2 36.8,10.15 36.75,10.15 36.75,8.75 36.7,8.75 36.7,8.45 36.55,8.45 36.55,7.75 33.1,7.75 33.1,8.2 33.15,8.2 33.15,8.3 33.2,8.3 33.2,8.35 33.25,8.35 v33.25,8.5 | v25.15,16.4 U3.37
CLK-12M-FPGA  (via drill 0.2 pad 0.3)
  Top 0.076: U1.L17 v49.65,11.74
CLK-12M-FT  (via drill 0.2 pad 0.3)
  Top 0.2: U2.2 v30.12,8.37
  Bottom 0.1: U2.2 v30.12,8.37
CLK-12M-SHARED  (via drill 0.2 pad 0.3)
  Top 0.1: Q1.3 v24.77,18.13 | R24.1 v22.95,16.26 | R25.1 v25.36,18.12
  Route3 0.1: v25.36,18.12 v24.77,18.13 v22.95,16.26
D0  (via drill 0.2 pad 0.3)
  Top 0.09: v44.68,4.98 44.68,5.28 44.75,5.56 44.82,5.84 44.89,6.13 44.96,6.41 45.03,6.69 45.1,6.97 45.18,7.26 45.25,7.54 45.25,7.74 45.25,7.99 45.5,7.99 U1.V8
  Route3 0.1: v44.68,4.98 44.45,5.3 v38,5.8
D1  (via drill 0.2 pad 0.3)
  Top 0.09: v43.88,4.98 43.88,5.28 43.98,5.56 44.09,5.84 44.2,6.13 44.32,6.41 44.43,6.69 44.54,6.97 44.64,7.26 44.75,7.54 44.75,7.74 44.75,7.99 45,7.99 U1.V7
  Bottom 0.1: v43.88,4.98 43.9,4.5 36.4,4.5 U3.4
D2  (via drill 0.2 pad 0.3)
  Top 0.09: v44.28,4.98 44.28,5.28 44.37,5.56 44.46,5.84 44.55,6.13 44.64,6.41 44.73,6.69 44.82,6.97 44.91,7.26 45,7.54 U1.W7
  Bottom 0.1: v44.28,4.98 44.3,4.25 36.15,4.25 U3.5
D3  (via drill 0.2 pad 0.3)
  Top 0.09: v43.48,4.98 43.48,5.28 43.6,5.56 43.73,5.84 43.86,6.13 43.99,6.41 44.12,6.69 44.25,6.97 44.38,7.26 44.5,7.54 U1.W6
D4  (via drill 0.2 pad 0.3)
  Top 0.076: U1.U5 v44.24,9.62
  Route3 0.1: v44.24,9.62 44.25,9.3 44.2,9.3 44.2,9.2 44.15,9.2 44.15,8.55 45.75,8.55 45.75,8.5 45.85,8.5 45.85,8.4 45.9,8.4 45.9,6.25 v53,6.25 | v37.55,23.25 37.6,24.2 37.2,24.6 30.7,24.45 30.5,23.55 30.3,23.4 28.55,23.15 25.95,22.35 18.15,18.1 v18.15,6.9
  Route4 0.1: v46.95,19.15 46.95,19.35 46.6,19.35 46.6,19.65 46.55,19.65 46.55,19.7 46.4,19.7 46.4,21.95 46.35,21.95 46.35,22 46.3,22 46.3,22.05 46.25,22.05 46.25,22.1 46.2,22.1 46.2,22.15 46.15,22.15 46.15,22.2 38.1,22.2 38.1,22.25 38.05,22.25 38.05,22.6 37.9,22.6 37.9,22.75 37.75,22.75 37.75,22.85 37.65,22.85 37.65,22.9 37.6,22.9 37.6,22.95 37.55,22.95 v37.55,23.25 | v18.15,6.9 18.2,4.15 31.9,4.15 v32.05,4.65
  Bottom 0.1: v53,6.25 52.2,6.25 52.2,16.1 52.15,16.1 52.15,16.2 52.1,16.2 52.1,16.25 52.05,16.25 52.05,16.3 50.75,16.3 50.75,17.2 50.7,17.2 50.7,17.3 50.65,17.3 50.65,17.4 50.6,17.4 50.6,17.5 50.55,17.5 50.55,17.6 50.5,17.6 50.5,17.7 50.45,17.7 50.45,17.8 50.4,17.8 50.4,17.85 50.35,17.85 50.35,17.9 49.2,17.9 49.2,18.65 49.05,18.65 49.05,18.7 49,18.7 49,18.75 48.95,18.75 48.95,18.8 48.9,18.8 48.9,18.85 48.85,18.85 48.85,18.9 46.95,18.9 v46.95,19.15 | v32.05,4.65 33.15,4.75 U3.8
D5  (via drill 0.2 pad 0.3)
  Top 0.09: v42.68,4.98 42.68,5.28 42.84,5.56 43,5.84 43.17,6.13 43.35,6.41 43.52,6.69 43.69,6.97 43.85,7.26 44,7.54 U1.W5
  Route3 0.1: v42.68,4.98 41.5,3 v35.45,2.95
  Route4 0.1: v33.95,4.05 v31.85,5.15
  Bottom 0.1: v35.45,2.95 35.35,2.95 35.35,3 35.25,3 35.25,3.15 35.2,3.15 35.2,3.25 35.05,3.25 35.05,3.3 34,3.3 34,4.05 v33.95,4.05 | v31.85,5.15 U3.10
D6  (via drill 0.2 pad 0.3)
  Top 0.09: v42.28,4.98 42.28,5.28 42.45,5.56 42.64,5.84 42.83,6.13 43.02,6.41 43.22,6.69 43.4,6.97 43.58,7.26 43.75,7.54 43.75,7.74 43.75,7.99 44,7.99 U1.V5
D7  (via drill 0.2 pad 0.3)
  Top 0.076: U1.U4 v43.89,9.41
D8  (via drill 0.2 pad 0.3)
  Top 0.09: v39.24,11.94 39.54,11.94 39.82,11.94 40.1,11.9 40.39,11.86 40.67,11.81 40.95,11.76 41.23,11.73 41.52,11.72 41.8,11.74 U1.L1
D9  (via drill 0.2 pad 0.3)
  Top 0.076: U1.K3 v43.35,12.24
  Route3 0.1: v43.35,12.24 41.5,14.5 40.8,16.1 v37,16.1
  Route4 0.1: v37,16.1 v36.75,18.25
  Bottom 0.1: v36.75,18.25 31.4,18.2 31.15,17.95 U3.44
D10  (via drill 0.2 pad 0.3)
  Top 0.09: v39.24,12.34 39.54,12.34 39.82,12.32 40.1,12.27 40.39,12.2 40.67,12.13 40.95,12.06 41.23,12.02 41.52,11.99 41.8,11.99 42,11.99 42.25,11.99 42.25,12.24 U1.K2
D11  (via drill 0.2 pad 0.3)
  Top 0.09: v39.24,13.54 39.54,13.54 39.82,13.47 40.1,13.36 40.39,13.23 40.67,13.1 40.95,12.97 41.23,12.87 41.52,12.79 41.8,12.74 U1.J1
D12  (via drill 0.2 pad 0.3)
  Top 0.076: U1.J3 v43.35,12.74
D13  (via drill 0.2 pad 0.3)
  Top 0.09: v39.24,14.34 39.54,14.34 39.82,14.23 40.1,14.08 40.39,13.91 40.67,13.74 40.95,13.58 41.23,13.43 41.52,13.32 41.8,13.24 U1.H1
  Route3 0.1: v39.24,14.34 39.6,14.55 39.5,15.1 v37.1,15.15
  Bottom 0.1: v37.1,15.15 35.55,16.1 U3.50
D14  (via drill 0.2 pad 0.3)
  Top 0.09: v49.36,19.5 49.36,19.2 49.25,18.92 49.15,18.64 49.04,18.35 48.94,18.07 48.84,17.79 48.73,17.5 48.62,17.22 48.5,16.94 U1.A14
  Route3 0.1: v39.85,18.15 37.55,17.95 v36.6,16.35
  Route4 0.1: v42.95,19.35 v39.85,18.15
  Bottom 0.1: v49.36,19.5 48.45,19.5 48.45,19.65 48.4,19.65 48.4,19.75 48.3,19.75 48.3,19.8 48.2,19.8 48.2,19.85 47.2,19.85 47.2,19.8 47.1,19.8 47.1,19.75 46.95,19.75 46.95,19.65 45.75,19.65 45.75,19.6 45.7,19.6 45.7,19.55 45.65,19.55 45.65,19.5 45.6,19.5 45.6,19.45 45.55,19.45 45.55,19.35 v42.95,19.35 | v36.6,16.35 U3.51
D15  (via drill 0.2 pad 0.3)
  Top 0.09: v50.16,19.5 50.16,19.2 50.02,18.92 49.87,18.64 49.73,18.35 49.59,18.07 49.44,17.79 49.3,17.5 49.15,17.22 49,16.94 U1.A15
  Route3 0.1: v50.16,19.5 50.15,18.9 48.4,18.9 48.4,18.8 48.35,18.8 48.35,18.75 48.3,18.75 48.3,18.7 48.25,18.7 48.25,18.4 48.1,18.4 48.1,18.35 48.05,18.35 48.05,18.3 48,18.3 48,18.25 46.1,18.25 46.1,18.35 46,18.35 v46,18.65 | v40.15,17.6 v38,17.2
  Bottom 0.1: v46,18.65 v40.15,17.6
DONE  (via drill 0.2 pad 0.3)
  Top 0.2: U2.22 v38.85,11.3
EE-CLK  (via drill 0.2 pad 0.3)
  Top 0.2: U2.62 v29.3,9.37
EE-CS  (via drill 0.2 pad 0.3)
  Top 0.2: U2.63 v29.9,8.82
  Route4 0.1: v29.9,8.82 29.55,10 29.8,18.75 30.35,19.75 32.8,20.05 32.85,21.5 33,21.6 33.3,21.6 33.25,23.25 30.2,24.6 28.4,24.6 28.3,23.7 27.75,23.2 v9.89,19.06 v7.24,13.38
  Bottom 0.1: R98.1 v7.24,13.38 | U10.1 v9.89,19.06
EE-DATA  (via drill 0.2 pad 0.3)
  Top 0.2: U2.61 v29.91,9.96
EE-DATA-DO  (via drill 0.2 pad 0.3)
  Route3 0.1: v2.24,12.98 3.95,13.3 v6.03,12.98 9.1,13 v9.11,13.3
  Bottom 0.1: R101.1 v2.24,12.98 | R97.1 v6.03,12.98 | U10.4 v9.11,13.3
EN_BIAS  (via drill 0.2 pad 0.3)
  Bottom 0.1: U8.12 v9.5,6.69
  Bottom 0.2: U8.12 v9.5,6.69 | U8.13 v10.1,7.19
FB1_NODE  (via drill 0.2 pad 0.3)
  Bottom 0.2: U8.8 v12.75,4.54
FB2_NODE  (via drill 0.2 pad 0.3)
  Bottom 0.2: U8.7 v14.05,4.15
FB3_NODE  (via drill 0.2 pad 0.3)
  Bottom 0.2: U8.9 v11.7,4.04
FLASH-CS#  (via drill 0.2 pad 0.3)
  Top 0.09: v53.76,12.7 53.46,12.7 53.18,12.66 52.9,12.59 52.61,12.51 52.33,12.43 52.05,12.36 51.77,12.29 51.48,12.25 51.2,12.24 U1.K19
FLASH-D00  (via drill 0.2 pad 0.3)
  Top 0.09: v53.76,17.5 53.46,17.5 53.18,17.26 52.9,17.01 52.61,16.73 52.33,16.46 52.05,16.19 51.77,15.93 51.48,15.7 51.2,15.49 51,15.49 50.75,15.49 50.75,15.24 U1.D18
FLASH-D01  (via drill 0.2 pad 0.3)
  Top 0.09: v53.76,17.1 53.46,17.1 53.18,16.88 52.9,16.64 52.61,16.39 52.33,16.13 52.05,15.88 51.77,15.65 51.48,15.43 51.2,15.24 U1.D19
FLASH-D02  (via drill 0.2 pad 0.3)
  Top 0.09: v53.76,15.1 53.46,15.1 53.18,14.97 52.9,14.83 52.61,14.68 52.33,14.52 52.05,14.37 51.77,14.23 51.48,14.1 51.2,13.99 51,13.99 50.75,13.99 50.75,13.74 U1.G18
FLASH-D03  (via drill 0.2 pad 0.3)
  Top 0.09: v53.76,15.9 53.46,15.9 53.18,15.73 52.9,15.55 52.61,15.36 52.33,15.17 52.05,14.98 51.77,14.8 51.48,14.63 51.2,14.49 51,14.49 50.75,14.49 50.75,14.24 U1.F18
FPGA-CCLK  (via drill 0.2 pad 0.3)
  Top 0.076: U1.C11 v47,15.39
FPGA-DONE  (via drill 0.2 pad 0.3)
  Top 0.076: U1.U12 v47.5,9.09
FPGA-INIT#  (via drill 0.2 pad 0.3)
  Top 0.076: U1.U11 v47,9.09
FPGA-TCK  (via drill 0.2 pad 0.3)
  Top 0.076: U1.C8 v45.5,15.39
FPGA-TDI  (via drill 0.2 pad 0.3)
  Top 0.09: v46.68,4.98 46.68,5.28 46.66,5.56 46.64,5.84 46.61,6.13 46.57,6.41 46.54,6.69 46.52,6.97 46.51,7.26 46.5,7.54 U1.W10
FPGA-TDO  (via drill 0.2 pad 0.3)
  Top 0.09: v45.08,4.98 45.08,5.28 45.13,5.56 45.18,5.84 45.23,6.13 45.28,6.41 45.33,6.69 45.39,6.97 45.44,7.26 45.5,7.54 U1.W8
FPGA-TMS  (via drill 0.2 pad 0.3)
  Top 0.09: v45.88,4.98 45.88,5.28 45.9,5.56 45.91,5.84 45.92,6.13 45.93,6.41 45.94,6.69 45.95,6.97 45.97,7.26 46,7.54 U1.W9
FT-PWREN#  (via drill 0.2 pad 0.3)
  Top 0.076: U1.P17 v49.65,10.24
  Top 0.1: v28.1,10.4 U2.60
  Top 0.2: U2.60 v27.34,10.2
  Route4 0.1: v27.34,10.2 v28.1,10.4
FT-REF  (via drill 0.2 pad 0.3)
  Top 0.2: U2.6 v31.86,9.01
FT-RESETN  (via drill 0.2 pad 0.3)
  Top 0.2: U2.14 v35.86,8.41
FT-VCORE  (via drill 0.2 pad 0.3)
  Top 0.25: v28.95,8.19 28.85,6.65 v27.41,4.86 27.4,4.3 30.15,4.3 v30.71,4.86 30.7,6.7 34.55,6.7 34.7,6.8 v34.95,8.1 | v28.95,16.23 31.7,15 34.95,15 v34.95,16.31
  Top 0.3: U2.12 v34.95,8.1 | U2.37 v34.95,16.31 | U2.49 v28.95,16.23 | U2.64 v28.95,8.19 | C139.2 v27.41,4.86 | C39.2 v30.71,4.86
  Route4 0.25: v28.95,8.19 28.9,9.55 v28.95,16.23
FT-VPHY  (via drill 0.2 pad 0.3)
  Top 0.3: U2.4 v30.95,8.1 | L4.1 v30.49,18.33 | C40.2 v38.66,19.03
  Route4 0.25: v38.66,19.03 38.3,19 38.15,18.85 33.3,18.2 v30.49,18.33 v30.95,8.1
FT-VPLL  (via drill 0.2 pad 0.3)
  Top 0.3: U2.9 v33.45,8.1 | L5.1 v32.91,18.7 | C41.2 v31.14,19.23
  Route4 0.25: v31.14,19.23 v32.91,18.7 30.4,18.75 30.1,18.55 30.55,7.7 31.15,7.7 v33.45,8.1
GND  (via drill 0.2 pad 0.3)
  Top 0.076: U1.G11 v47,14.09 | U1.E17 v49.65,14.74 | U1.M13 v48.35,11.24 | U1.U9 v46,9.09 | U1.U6 v44.5,9.09 | U1.G7 v44.75,13.99
  Top 0.09: v47.31,19.5 47.31,19.2 47.27,18.92 47.23,18.64 47.19,18.35 47.15,18.07 47.11,17.79 47.07,17.5 47.03,17.22 47,16.94 U1.A11 | v49.76,19.5 49.76,19.2 49.63,18.92 49.51,18.64 49.39,18.35 49.26,18.07 49.14,17.79 49.01,17.5 48.88,17.22 48.75,16.94 48.75,16.74 48.75,16.49 48.5,16.49 U1.B14 | v52.96,19.5 52.96,19.2 52.72,18.91 52.5,18.62 52.29,18.33 52.09,18.04 51.89,17.75 51.66,17.46 51.42,17.17 51.14,16.88 U1.A19 | v53.76,17.9 53.46,17.9 53.18,17.65 52.9,17.37 52.61,17.08 52.33,16.78 52.05,16.49 51.77,16.22 51.48,15.96 51.2,15.74 U1.C19 | v53.76,15.5 53.46,15.5 53.18,15.35 52.9,15.19 52.61,15.02 52.33,14.84 52.05,14.68 51.77,14.52 51.48,14.37 51.2,14.24 U1.F19 | v53.76,14.3 53.46,14.3 53.18,14.2 52.9,14.1 52.61,13.99 52.33,13.88 52.05,13.77 51.77,13.66 51.48,13.57 51.2,13.49 51,13.49 50.75,13.49 50.75,13.24 U1.H18 | v53.76,11.9 53.46,11.9 53.18,11.89 52.9,11.87 52.61,11.83 52.33,11.79 52.05,11.75 51.77,11.73 51.48,11.72 51.2,11.74 U1.L19 | v53.76,7.9 53.46,7.9 53.18,8.07 52.9,8.23 52.61,8.4 52.33,8.56 52.05,8.72 51.77,8.89 51.48,9.06 51.2,9.24 U1.T19 | v53.08,4.98 53.08,5.28 52.8,5.56 52.5,5.84 52.2,6.13 51.89,6.41 51.59,6.69 51.29,6.97 51.01,7.26 50.75,7.54 50.75,7.74 50.75,7.99 50.5,7.99 U1.V18 | v47.88,4.98 47.88,5.28 47.82,5.56 47.78,5.84 47.74,6.13 47.7,6.41 47.65,6.69 47.61,6.97 47.56,7.26 47.5,7.54 U1.W12 | v39.48,4.98 39.54,5.28 39.83,5.57 40.12,5.86 40.41,6.15 40.7,6.44 40.99,6.73 41.28,7.02 41.57,7.31 41.86,7.6 U1.W1 | v39.24,9.14 39.54,9.14 39.82,9.26 40.1,9.36 40.39,9.46 40.67,9.55 40.95,9.64 41.23,9.75 41.52,9.86 41.8,9.99 42,9.99 42.25,9.99 42.25,10.24 U1.P2
  Top 0.09: v39.24,19.5 39.54,19.2 39.83,18.91 40.12,18.62 40.41,18.33 40.7,18.04 40.99,17.75 41.28,17.46 41.57,17.17 41.86,16.88 U1.A1
  Top 0.225: U1.L11 U1.J11 U1.H11 | U1.N12 U1.N13 U1.M13 | U1.N9 U1.M9 U1.L9 U1.L8 U1.K8 U1.J8 U1.H8 U1.G8 | U1.J9 U1.H9 U1.G9 U1.G8 | U1.J12 U1.H12 U1.H11 | U1.H7 U1.G7 U1.G8 | U1.G11 U1.H11 | U1.G1 U1.F1 U1.E1 U1.E2 | U1.E3 U1.F3 | U1.E2 U1.F2 | U1.E2 U1.E3 | U1.E3 U1.D3 U1.C3 | U1.C3 U1.C2 U1.C1 U1.B1 U1.A1 | U1.C7 U1.B7 U1.A7 U1.A6 | U1.C6 U1.B6 U1.A6 | U1.C5 U1.B5 U1.A5 | U1.C4 U1.B4 U1.A4 | U1.C3 U1.B3 U1.A3 U1.A4 | U1.A9 U1.B9 U1.C10 U1.B11 U1.A11 | U1.A5 U1.A6 | U1.A4 U1.A5
  other vias: 2.3,0.55 5.05,0.55 7.8,0.55 12.55,0.55 15.3,0.55 18.05,0.55 22.8,0.55 25.55,0.55 30.3,0.55 33.05,0.55 35.8,0.55 40.55,0.55 43.3,0.55 48.05,0.55 50.8,0.55 53.55,0.55 58.3,0.55 10.05,2.05 20.3,2.05 27.8,2.05 38.05,2.05 0.55,2.55 6.8,3.05 23.8,3.05 34.3,3.8 13.55,4.3 52.05,4.55 3.55,4.8 0.55,5.3 8.55,5.55 40.55,6.8 59.3,15.55 40.05,16.55 42.8,18.55 53.05,18.8 17.3,19.05 46.55,19.05 26.3,19.55 59.8,20.05 0.55,20.3 3.3,20.55 9.3,20.55 21.05,21.3 18.05,21.55 11.05,22.55 13.8,22.55 1.3,22.8 4.8,22.8 7.55,22.8 23.3,22.8 53.3,23.3 56.05,23.3 38.3,23.55 45.8,23.55 50.55,23.55 20.05,23.8 27.8,23.8 43.05,23.8 58.55,24.05 17.55,24.55 25.3,24.55
  pour Bottom (isolate 0.25): 0.4,0.4 60.56,0.4 60.56,25 0.4,25
  pour Route2 (isolate 0.25): 0.4,0.4 60.56,0.4 60.56,25 0.4,25
  pour Top (isolate 0.25): 0.4,0.4 60.56,0.4 60.56,25 0.4,25
GNDADC  (via drill 0.2 pad 0.3)
  Top 0.09: v48.11,19.5 48.11,19.2 48.04,18.92 47.96,18.64 47.88,18.35 47.8,18.07 47.71,17.79 47.64,17.5 47.56,17.22 47.5,16.94 U1.A12
  Top 0.225: U1.C12 U1.B12 U1.A12 U1.A13 U1.B13
JA1  (via drill 0.2 pad 0.3)
  Top 0.09: v53.76,6.7 53.46,6.7 53.18,6.92 52.9,7.14 52.61,7.37 52.33,7.59 52.05,7.82 51.77,8.04 51.48,8.27 51.2,8.49 51,8.49 50.75,8.49 50.75,8.74 U1.U18
JA2  (via drill 0.2 pad 0.3)
  Top 0.09: v53.76,7.1 53.46,7.1 53.18,7.3 52.9,7.51 52.61,7.71 52.33,7.92 52.05,8.12 51.77,8.32 51.48,8.53 51.2,8.74 U1.U19
JA3  (via drill 0.2 pad 0.3)
  Top 0.076: U1.G17 v49.65,13.74
  Route3 0.1: v53.85,5.2 60.6,5.05 59.7,9.5 R28.1
  Route4 0.1: v49.65,13.74 51.85,11.05 52.25,5.6 v53.85,5.2
JA4  (via drill 0.2 pad 0.3)
  Top 0.076: U1.C17 v49.75,15.49
JA7  (via drill 0.2 pad 0.3)
  Top 0.076: U1.T17 v49.33,9.63
  Route3 0.1: v46.75,18.6 47.9,18.6 47.9,18.65 48,18.65 48,18.85 48.05,18.85 48.05,18.9 48.1,18.9 48.1,18.95 48.15,18.95 48.15,19.05 48.2,19.05 48.2,19.1 48.25,19.1 48.25,19.15 48.45,19.15 48.45,19.65 48.4,19.65 48.4,19.75 48.3,19.75 48.3,19.8 48.2,19.8 48.2,19.85 47.75,19.85 47.75,19.9 47.7,19.9 47.7,19.95 47.65,19.95 47.65,20 47.55,20 47.55,20.05 47.5,20.05 47.5,23.1 v47.45,23.1 | v59.85,15.1 59.8,12.75 R30.2